# Altium project BEE-DAL_EXP.PrjPcb (part 1 of 2)
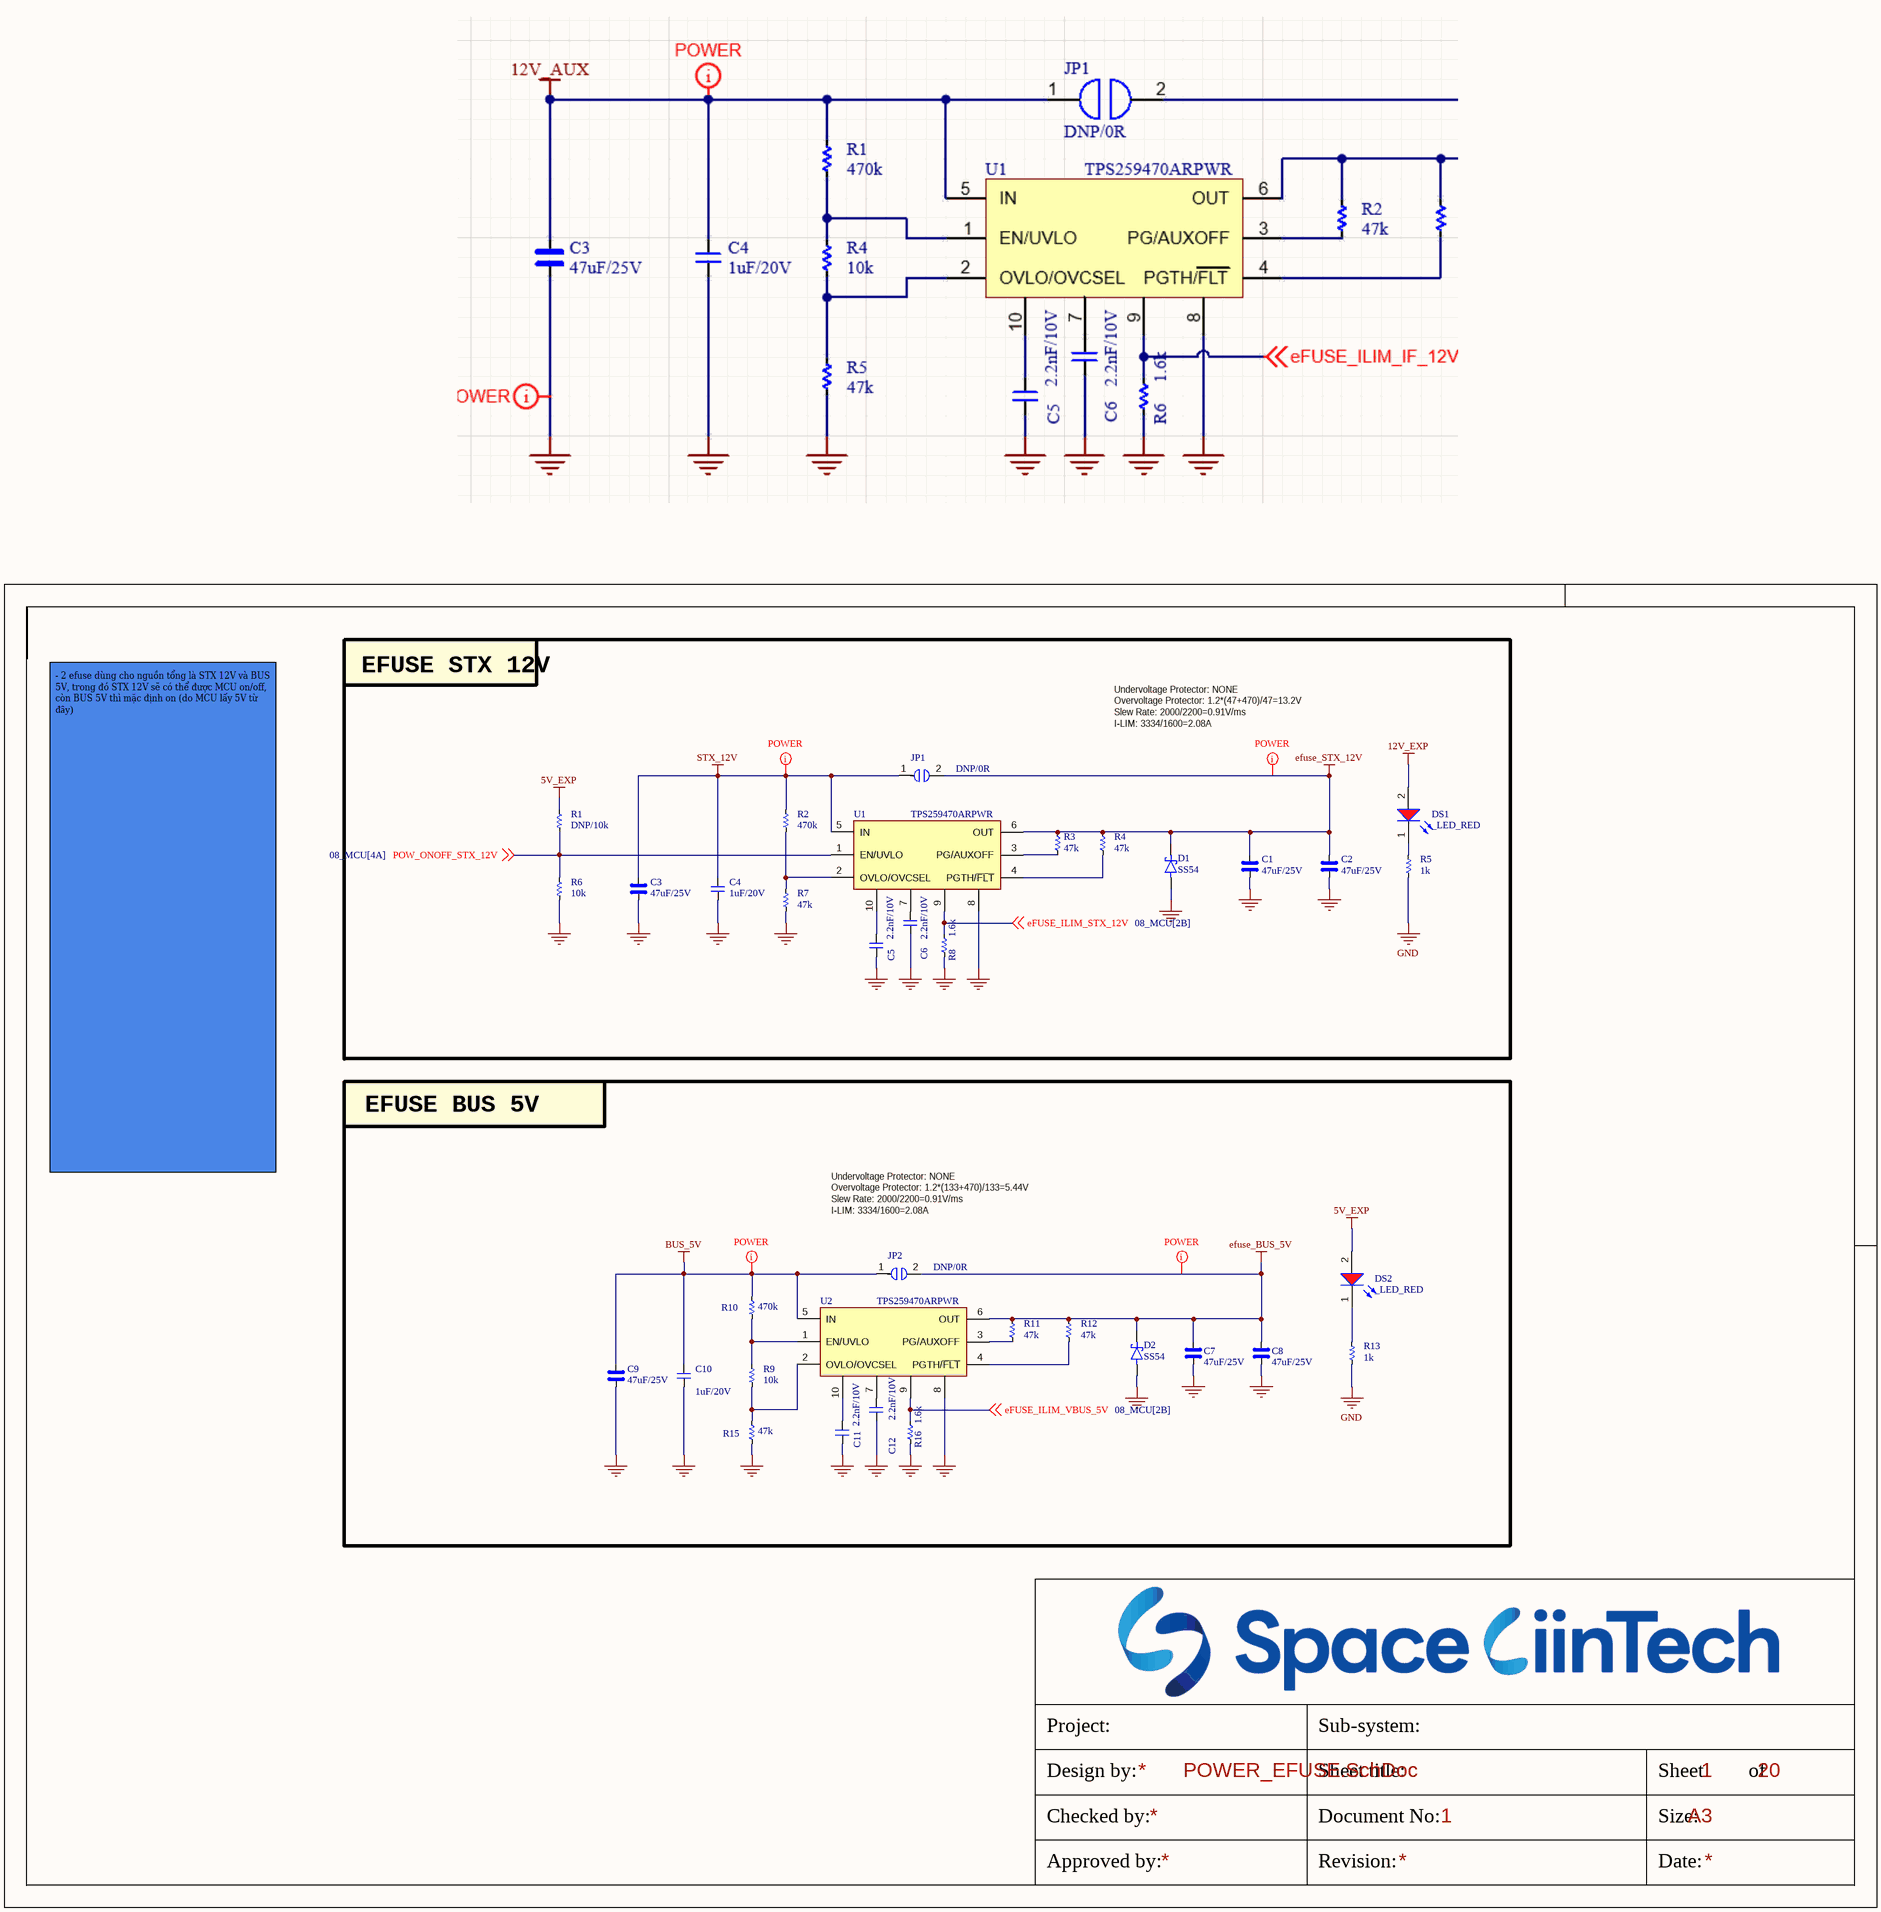
[diagram p0: POWER_EFUSE.SchDoc]
19 sheets, 584 parts. Net scope: flat (ports and power ports of the same name join across sheets).
Sheets:
  POWER_EFUSE.SchDoc
  07_CAN.SchDoc
  09_CONSOLE.SchDoc
  08_MCU.SchDoc
  10_PRAM_RTC_WDT.SchDoc
  13_FLOW_Sensor.SchDoc
  14_I2C_Sensor_OnBoard.SchDoc
  15_HD_PUMP.SchDoc
  16_SOLENOID_HB_1.SchDoc
  IR_LED.SchDoc
  STEP_MOTOR_DRIVER_1.SchDoc
  STEP_MOTOR_DRIVER_2.SchDoc
  STEP_MOTOR_ISOLATOR_INPUT.SchDoc
  CONNECTOR_INTERFACE.SchDoc
  POWER_MEASUREMENT.SchDoc
  POWER.SchDoc
  FUNCTION_EFUSE.SchDoc
  RS485.SchDoc
  CAM_CONNECTOR.SchDoc

## Sheet POWER_EFUSE.SchDoc
size 420 x 297 mm; SheetNumber: 1; SheetTotal: 20

### Parts
C1  47uF/25V  [CAP_C_3225X80]
C2  47uF/25V  [CAP_C_3225X80]
C3  47uF/25V  [CAP_C_3225X80]
C4  1uF/20V  [CAP_C_1005X50_L]
C5  2.2nF/10V  [CAP_C_1005X50_L]
C6  2.2nF/10V  [CAP_C_1005X50_L]
C7  47uF/25V  [CAP_C_3225X80]
C8  47uF/25V  [CAP_C_3225X80]
C9  47uF/25V  [CAP_C_3225X80]
C10  1uF/20V  [CAP_C_1005X50_L]
C11  2.2nF/10V  [CAP_C_1005X50_L]
C12  2.2nF/10V  [CAP_C_1005X50_L]
D1  SS54  [DO-214AC_SMA]
D2  SS54  [DO-214AC_SMA]
DS1  _LED_RED  [LED_0603]
DS2  _LED_RED  [LED_0603]
JP1  DNP/0R  [JUMPER_1608]
JP2  DNP/0R  [JUMPER_1608]
R1  DNP/10k  [RES_C_1005X40]
R2  470k  [RES_C_1005X40]
R3  47k  [RES_C_1005X40]
R4  47k  [RES_C_1005X40]
R5  1k  [RES_C_1005X40]
R6  10k  [RES_C_1005X40]
R7  47k  [RES_C_1005X40]
R8  1.6k  [RES_C_1005X40]
R9  10k  [RES_C_1005X40]
R10  470k  [RES_C_1005X40]
R11  47k  [RES_C_1005X40]
R12  47k  [RES_C_1005X40]
R13  1k  [RES_C_1005X40]
R15  47k  [RES_C_1005X40]
R16  1.6k  [RES_C_1005X40]
U1  TPS259470ARPWR  [VQFN-HR-10]
U2  TPS259470ARPWR  [VQFN-HR-10]

### Blocks framed on the sheet
EFUSE STX 12V: C1-C6 D1 DS1 JP1 R1-R8 U1
EFUSE BUS 5V: C7-C12 D2 DS2 JP2 R9-R13 R15 R16 U2

### Nets
5V_EXP: DS2.2(A) R1.1
12V_EXP: DS1.2(A)
BUS_5V: C9.2 C10.2 JP2.1 R10.2 U2.5(IN)
efuse_BUS_5V: C7.2 C8.2 D2.1(K) JP2.2 R11.2 R12.2 U2.6(OUT)
efuse_STX_12V: C1.2 C2.2 D1.1(K) JP1.2 R3.2 R4.2 U1.6(OUT)
GND: C1.1 C2.1 C3.1 C4.1 C5.1 C6.1 C7.1 C8.1 C9.1 C10.1 C11.1 C12.1 D1.2(A) D2.2(A) R5.1 R6.2 R7.1 R8.1 R13.1 R15.1 R16.1 U1.8 U2.8
STX_12V: C3.2 C4.2 JP1.1 R2.2 U1.5(IN)
eFUSE_ILIM_STX_12V: R8.2 U1.9 ; off-sheet eFUSE_ILIM_STX_12V
eFUSE_ILIM_VBUS_5V: R16.2 U2.9 ; off-sheet eFUSE_ILIM_VBUS_5V
POW_ONOFF_STX_12V: R1.2 R6.1 U1.1(EN/UVLO) ; off-sheet POW_ONOFF_STX_12V
NetC5_2: C5.2 U1.10
NetC6_2: C6.2 U1.7
NetC11_2: C11.2 U2.10
NetC12_2: C12.2 U2.7
NetDS1_1: DS1.1(K) R5.2
NetDS2_1: DS2.1(K) R13.2
NetR2_1: R2.1 R7.2 U1.2(OVLO/OVCSEL)
NetR3_1: R3.1 U1.3(PG/AUXOFF)
NetR4_1: R4.1 U1.4(PGTH/~{FLT})
NetR9_1: R9.1 R15.2 U2.2(OVLO/OVCSEL)
NetR9_2: R9.2 R10.1 U2.1(EN/UVLO)
NetR11_1: R11.1 U2.3(PG/AUXOFF)
NetR12_1: R12.1 U2.4(PGTH/~{FLT})

### Layout directives
net class POWER: BUS_5V, efuse_BUS_5V, efuse_STX_12V, STX_12V

### Notes on the sheet
- Undervoltage Protector: NONE
- Overvoltage Protector: 1.2*(47+470)/47=13.2V
- Slew Rate: 2000/2200=0.91V/ms
- I-LIM: 3334/1600=2.08A
- - 2 efuse dùng cho nguồn tổng là STX 12V và BUS 5V, trong đó STX 12V sẽ có thể được MCU on/off, còn BUS 5V thì mặc định on (do MCU lấy 5V từ đây)
- Overvoltage Protector: 1.2*(133+470)/133=5.44V
- Project:
- Sub-system:
- Design by:
- Sheet title:
- Sheet
- of
- Checked by:
- Approved by:
- Revision:
- Document No:
- Size:
- Date:
- A3

### Library data of the parts
C1-C3 C7-C9 = _CAP_C_High_2: CAP High Value
C4-C6 C10-C12 = _CAP_C_2: CAP
D1 D2 = DIODE SCHOTTKY
JP1 JP2 = JUMPER_1_1
R1-R13 R15 R16 = _RES_B_2: RES

## Sheet 07_CAN.SchDoc
size 420 x 297 mm; SheetNumber: 2; SheetTotal: 20
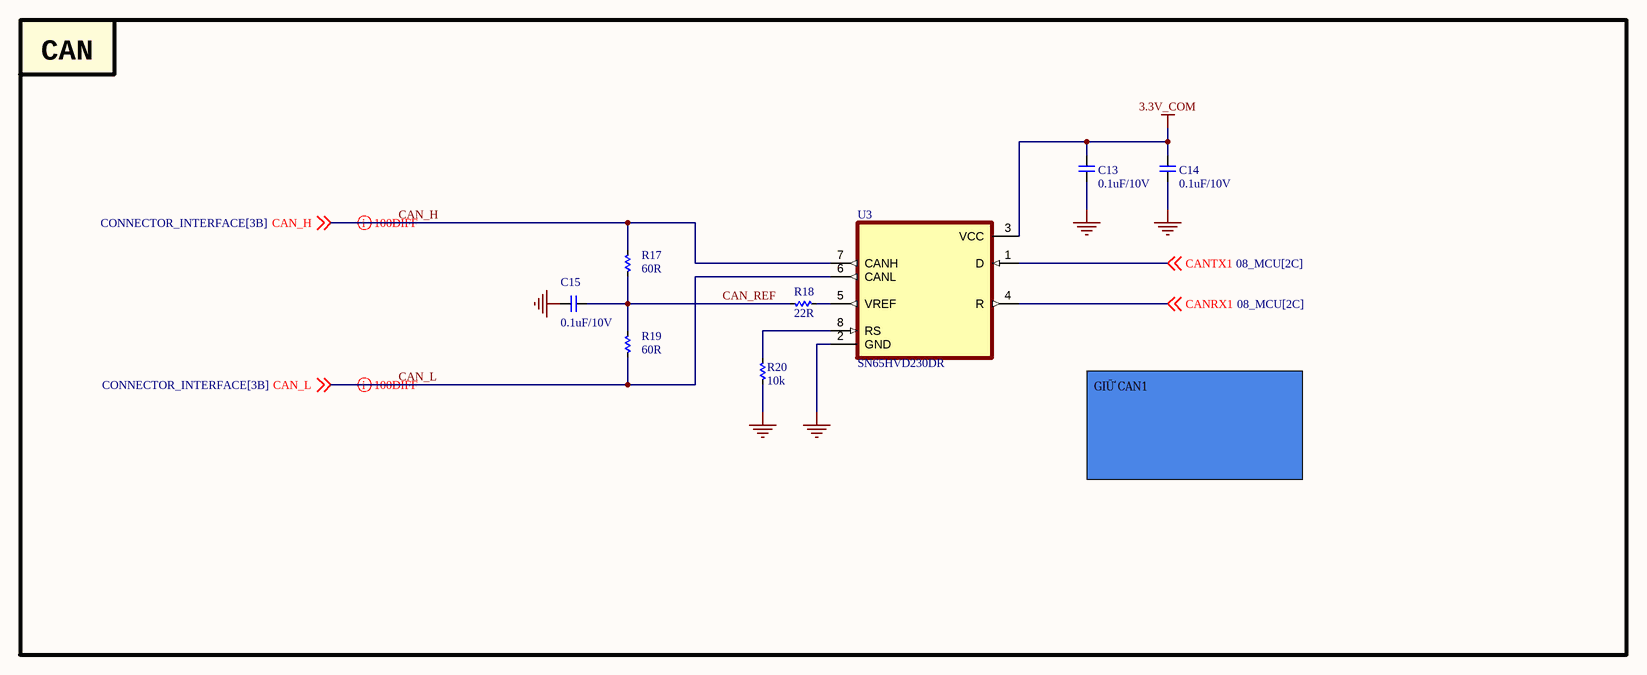
[diagram p1: 07_CAN.SchDoc]

### Parts
C13  0.1uF/10V  [CAP_C_1005X50_L]
C14  0.1uF/10V  [CAP_C_1005X50_L]
C15  0.1uF/10V  [CAP_C_1005X50_L]
R17  60R  [RES_C_1005X40]
R18  22R  [RES_C_1005X40]
R19  60R  [RES_C_1005X40]
R20  10k  [RES_C_1005X40]
U3  SN65HVD230DR  [SOIC127P600X175-8N]

### Blocks framed on the sheet
CAN: C13-C15 R17-R20 U3

### Nets
3.3V_COM: C13.1 C14.1 U3.3(VCC)
GND: C13.2 C14.2 C15.2 R20.1 U3.2(GND)
CAN_H: R17.2 U3.7(CANH) ; off-sheet CAN_H
CAN_L: R19.1 U3.6(CANL) ; off-sheet CAN_L
CAN_REF: C15.1 R17.1 R18.1 R19.2
CANRX1: U3.4(R) ; off-sheet CANRX1
CANTX1: U3.1(D) ; off-sheet CANTX1
NetR18_2: R18.2 U3.5(VREF)
NetR20_2: R20.2 U3.8(RS)

### Layout directives
differential pair; differential pair class DIFF100: CAN_H, CAN_L

### Notes on the sheet
- GIỮ CAN1
- Project:
- Sub-system:
- Design by:
- Sheet title:
- Sheet
- of
- Checked by:
- Approved by:
- Revision:
- Document No:
- Size:
- Date:
- A3

### Library data of the parts
C13-C15 = _CAP_C_2: CAP
R17-R20 = _RES_B_2: RES
U3 = SN65HVD230DR: 3.3 V CAN Transceiver with Standby Mode; MF: Texas Instruments; SnapEDA_Link: https://www.snapeda.com/parts/SN65HVD230DR/Texas+Instruments/view-part/?ref=snap; Package: SOIC-8 Texas Instruments; Value: *; MP: SN65HVD230DR; Check_prices: https://www.snapeda.com/parts/SN65HVD230DR/Texas+Instruments/view-part/?ref=eda

## Sheet 09_CONSOLE.SchDoc
size 420 x 297 mm; SheetNumber: 3; SheetTotal: 20
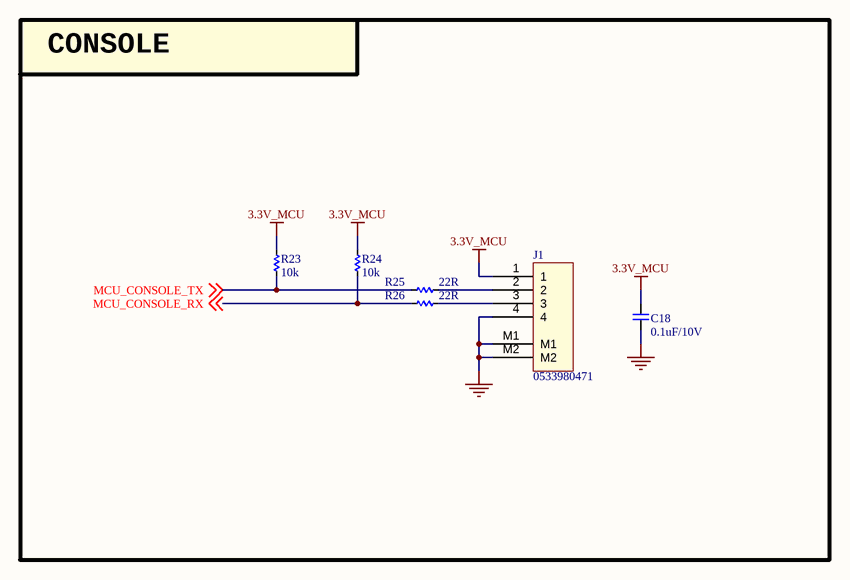
[diagram p2: 09_CONSOLE.SchDoc]

### Parts
C18  0.1uF/10V  [CAP_C_1005X50_L]
J1  0533980471  [MOLEX_0533980471]
R23  10k  [RES_C_1005X40]
R24  10k  [RES_C_1005X40]
R25  22R  [RES_C_1005X40]
R26  22R  [RES_C_1005X40]

### Blocks framed on the sheet
CONSOLE: C18 J1 R23-R26

### Nets
3.3V_MCU: C18.2 J1.1 R23.2 R24.2
GND: C18.1 J1.4 J1.M1 J1.M2
MCU_CONSOLE_RX: R24.1 R26.2 ; off-sheet MCU_CONSOLE_RX
MCU_CONSOLE_TX: R23.1 R25.2 ; off-sheet MCU_CONSOLE_TX
NetJ1_2: J1.2 R25.1
NetJ1_3: J1.3 R26.1

### Notes on the sheet
- Project:
- Sub-system:
- Design by:
- Sheet title:
- Sheet
- of
- Checked by:
- Approved by:
- Revision:
- Document No:
- Size:
- Date:
- A3

### Library data of the parts
C18 = _CAP_C_2: CAP
J1 = Header 4x1_2M
R23-R26 = _RES_B_2: RES

## Sheet 08_MCU.SchDoc
size 420 x 297 mm; SheetNumber: 8; SheetTotal: 27
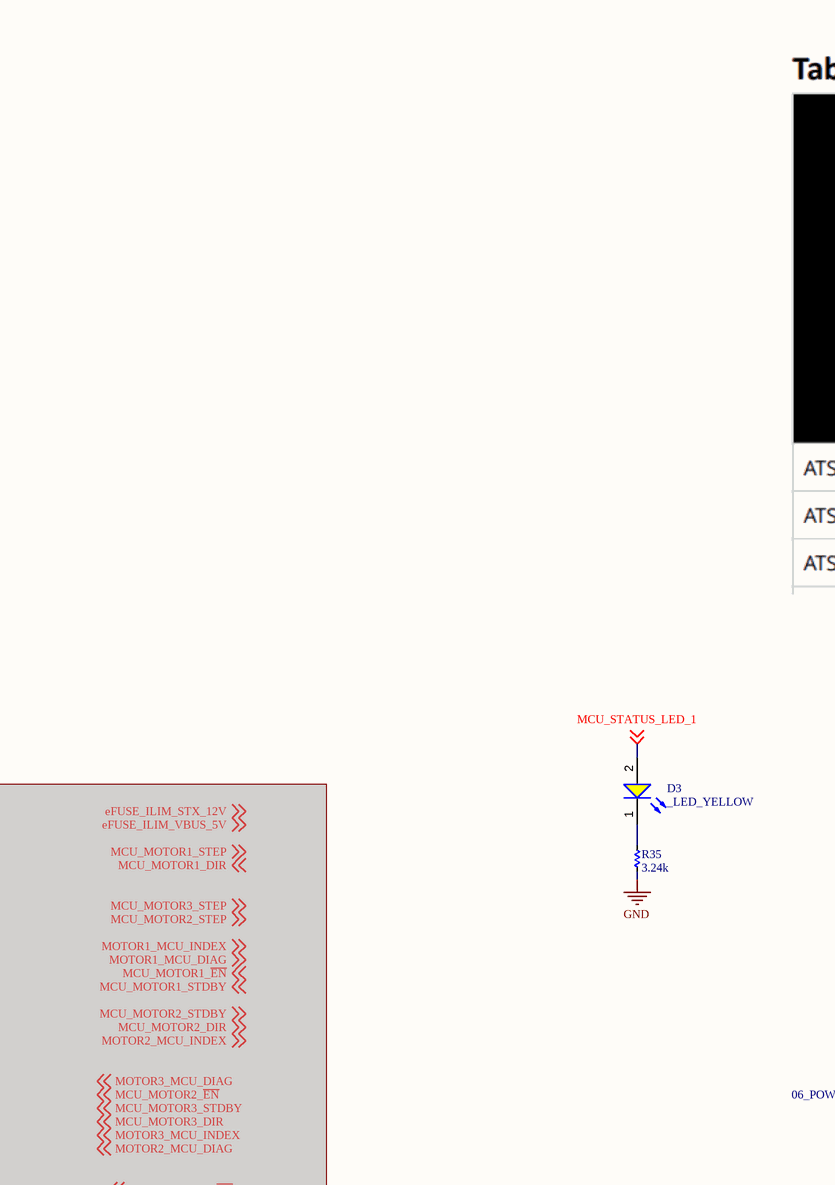
[diagram p3: 08_MCU.SchDoc, top left]
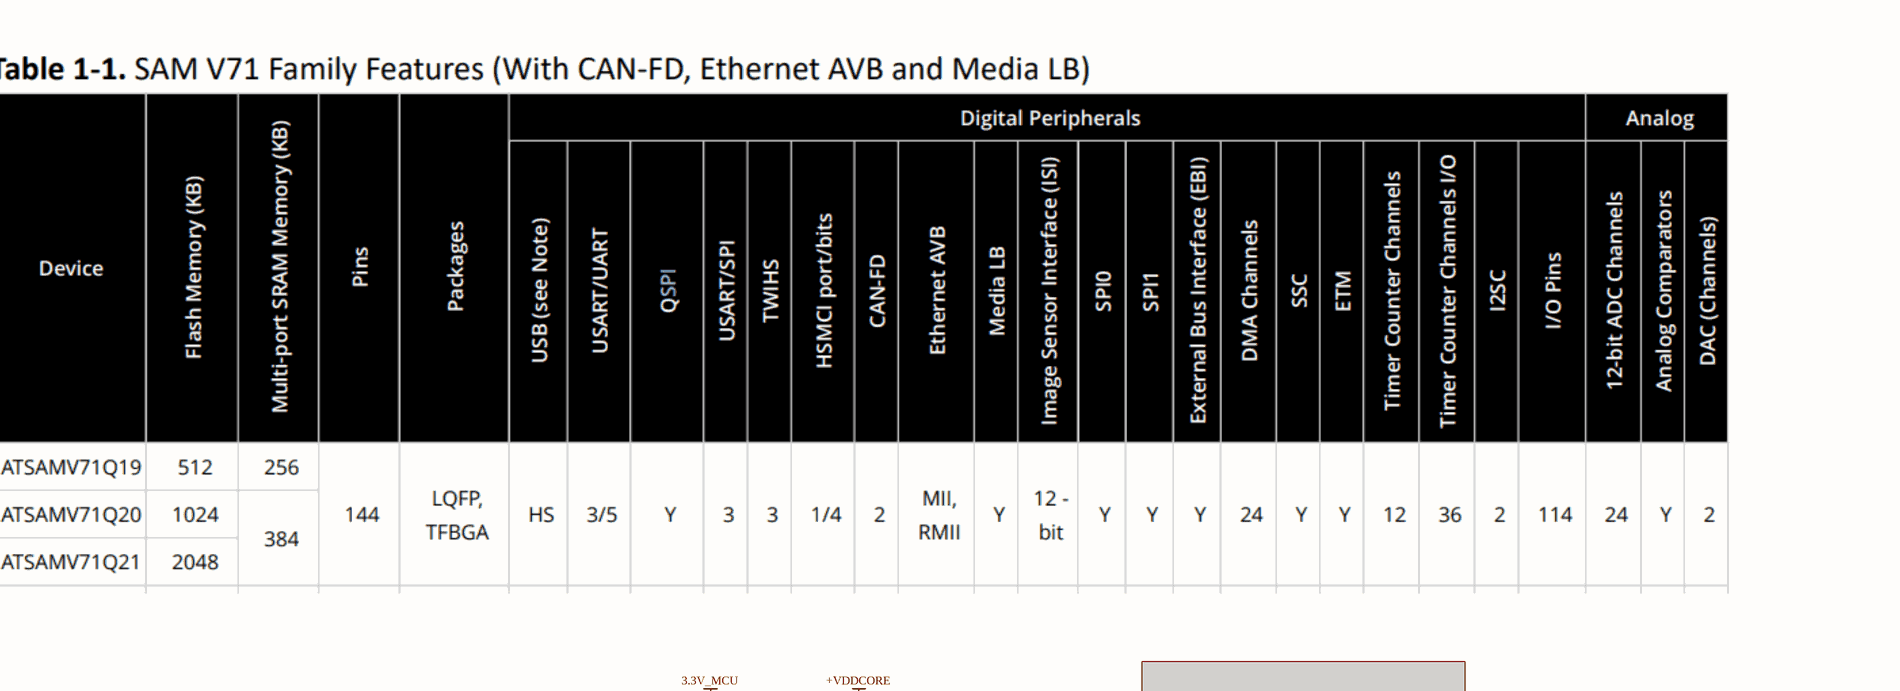
[diagram p4: 08_MCU.SchDoc, top right]
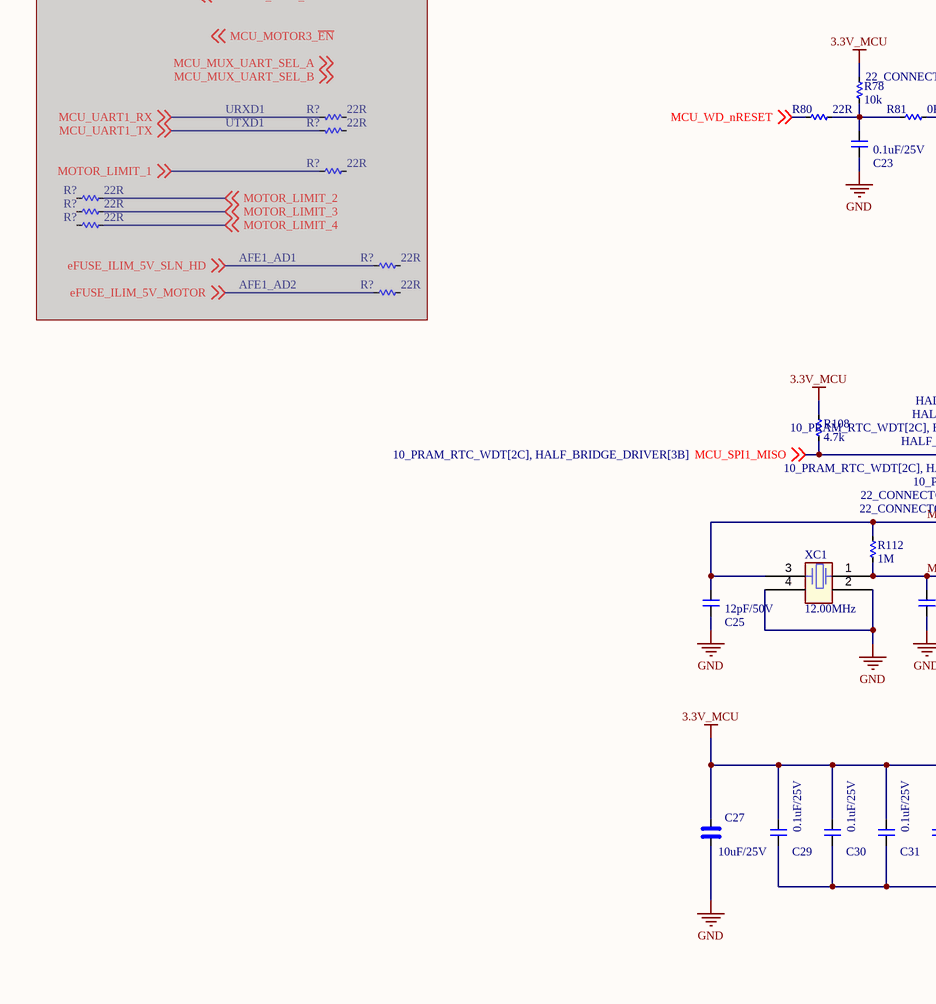
[diagram p5: 08_MCU.SchDoc, bottom left]
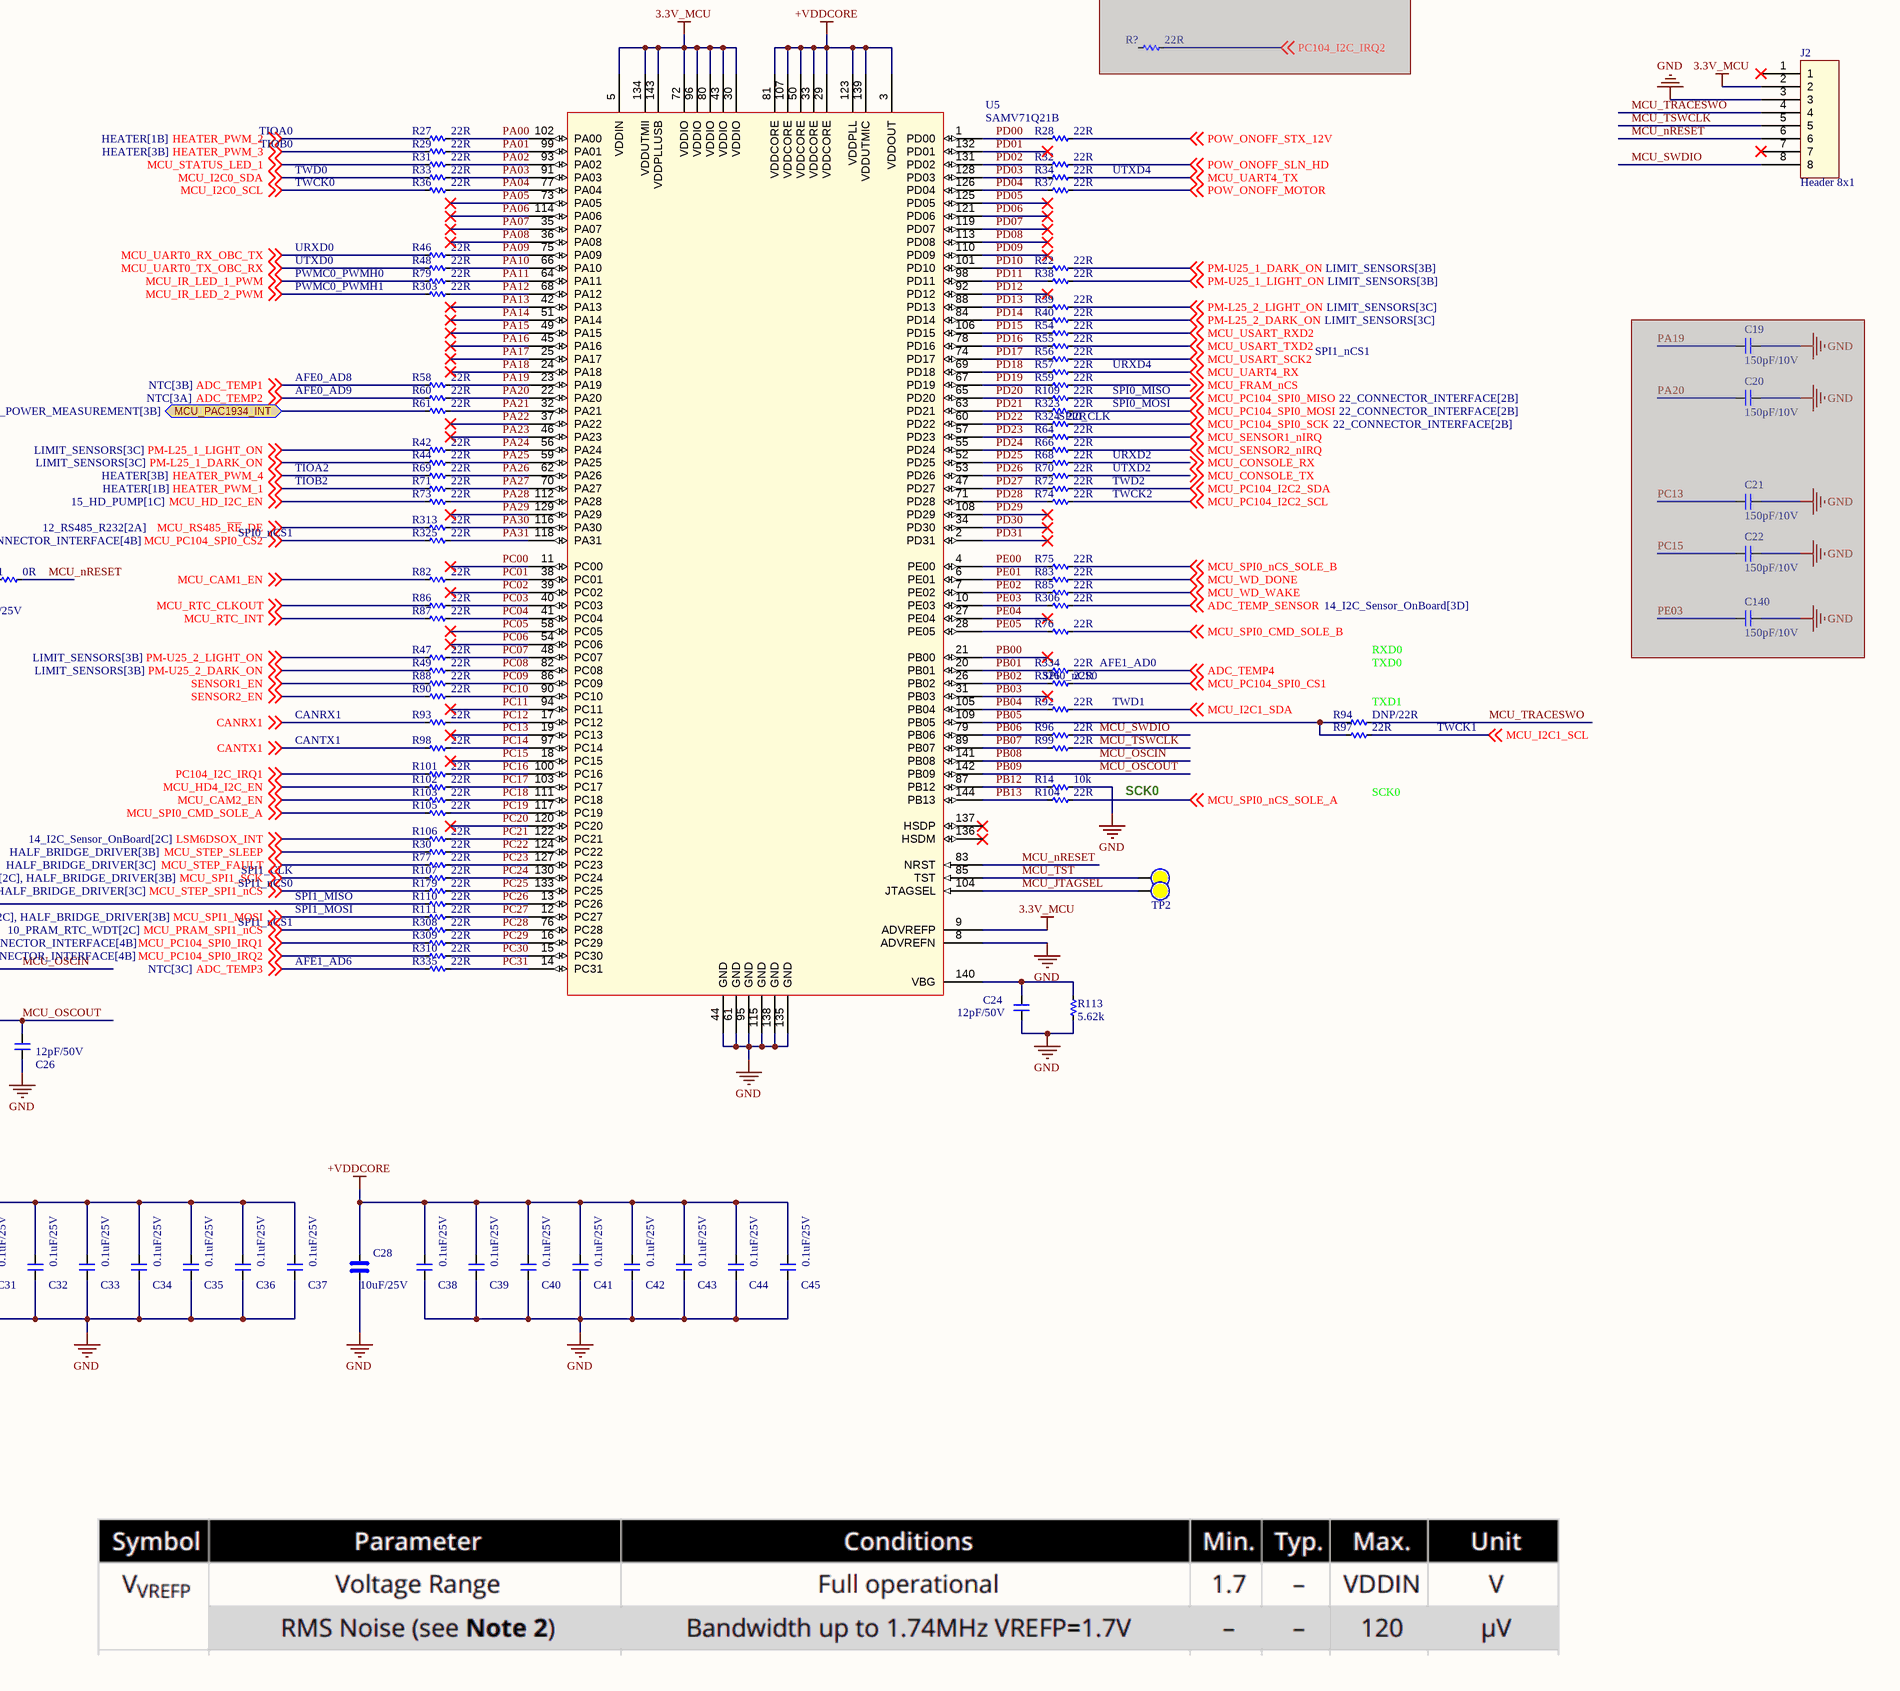
[diagram p6: 08_MCU.SchDoc, bottom right]

### Parts
(Parts that share a designator on the sheet are numbered #1, #2 ... from top to bottom, then left to right.)
C19  150pF/10V  [CAP_C_1005X60]  (masked out: inside a compile mask, not in the netlist)
C20  150pF/10V  [CAP_C_1005X60]  (masked out: inside a compile mask, not in the netlist)
C21  150pF/10V  [CAP_C_1005X60]  (masked out: inside a compile mask, not in the netlist)
C22  150pF/10V  [CAP_C_1005X60]  (masked out: inside a compile mask, not in the netlist)
C23  0.1uF/25V  [CAP_C_1005X60]
C24  12pF/50V  [CAP_C_1005X60]
C25  12pF/50V  [CAP_C_1005X60]
C26  12pF/50V  [CAP_C_1005X60]
C27  10uF/25V  [CAP_C_2012X110]
C28  10uF/25V  [CAP_C_2012X110]
C29  0.1uF/25V  [CAP_C_1005X60]
C30  0.1uF/25V  [CAP_C_1005X60]
C31  0.1uF/25V  [CAP_C_1005X60]
C32  0.1uF/25V  [CAP_C_1005X60]
C33  0.1uF/25V  [CAP_C_1005X60]
C34  0.1uF/25V  [CAP_C_1005X60]
C35  0.1uF/25V  [CAP_C_1005X60]
C36  0.1uF/25V  [CAP_C_1005X60]
C37  0.1uF/25V  [CAP_C_1005X60]
C38  0.1uF/25V  [CAP_C_1005X60]
C39  0.1uF/25V  [CAP_C_1005X60]
C40  0.1uF/25V  [CAP_C_1005X60]
C41  0.1uF/25V  [CAP_C_1005X60]
C42  0.1uF/25V  [CAP_C_1005X60]
C43  0.1uF/25V  [CAP_C_1005X60]
C44  0.1uF/25V  [CAP_C_1005X60]
C45  0.1uF/25V  [CAP_C_1005X60]
C140#1  150pF/10V  [CAP_C_1005X60]  (masked out: inside a compile mask, not in the netlist)
D3  _LED_YELLOW  [LED_0603]
J2  Header 8x1  [Header_254P_8x1]
R14  10k  [RES_C_1005X40]
R22  22R  [RES_C_1005X40]
R27  22R  [RES_C_1005X40]
R28  22R  [RES_C_1005X40]
R29  22R  [RES_C_1005X40]
R30  22R  [RES_C_1005X40]
R31  22R  [RES_C_1005X40]
R32  22R  [RES_C_1005X40]
R33  22R  [RES_C_1005X40]
R34  22R  [RES_C_1005X40]
R35  3.24k  [RES_C_1005X40]
R36  22R  [RES_C_1005X40]
R37  22R  [RES_C_1005X40]
R38  22R  [RES_C_1005X40]
R39  22R  [RES_C_1005X40]
R40  22R  [RES_C_1005X40]
R42  22R  [RES_C_1005X40]
R44  22R  [RES_C_1005X40]
R46  22R  [RES_C_1005X40]
R47  22R  [RES_C_1005X40]
R48  22R  [RES_C_1005X40]
R49  22R  [RES_C_1005X40]
R54  22R  [RES_C_1005X40]
R55  22R  [RES_C_1005X40]
R56  22R  [RES_C_1005X40]
R57  22R  [RES_C_1005X40]
R58  22R  [RES_C_1005X40]
R59  22R  [RES_C_1005X40]
R60  22R  [RES_C_1005X40]
R61  22R  [RES_C_1005X40]
R64  22R  [RES_C_1005X40]
R66  22R  [RES_C_1005X40]
R68  22R  [RES_C_1005X40]
R69  22R  [RES_C_1005X40]
R70  22R  [RES_C_1005X40]
R71  22R  [RES_C_1005X40]
R72  22R  [RES_C_1005X40]
R73  22R  [RES_C_1005X40]
R74  22R  [RES_C_1005X40]
R75  22R  [RES_C_1005X40]
R76  22R  [RES_C_1005X40]
R77#1  22R  [RES_C_1005X40]
R78  10k  [RES_C_1005X40]
R79  22R  [RES_C_1005X40]
R80  22R  [RES_C_1005X40]
R81  0R  [RES_C_1005X40]
R82  22R  [RES_C_1005X40]
R83  22R  [RES_C_1005X40]
R85  22R  [RES_C_1005X40]
R86  22R  [RES_C_1005X40]
R87  22R  [RES_C_1005X40]
R88  22R  [RES_C_1005X40]
R90  22R  [RES_C_1005X40]
R92  22R  [RES_C_1005X40]
R93  22R  [RES_C_1005X40]
R94  DNP/22R  [RES_C_1005X40]
R96  22R  [RES_C_1005X40]
R97  22R  [RES_C_1005X40]
R98  22R  [RES_C_1005X40]
R99  22R  [RES_C_1005X40]
R101  22R  [RES_C_1005X40]
R102  22R  [RES_C_1005X40]
R103  22R  [RES_C_1005X40]
R104  22R  [RES_C_1005X40]
R105  22R  [RES_C_1005X40]
R106  22R  [RES_C_1005X40]
R107  22R  [RES_C_1005X40]
R108  4.7k  [RES_C_1005X40]
R109  22R  [RES_C_1005X40]
R110  22R  [RES_C_1005X40]
R111  22R  [RES_C_1005X40]
R112  1M  [RES_C_1005X40]
R113  5.62k  [RES_C_1005X40]
R179#1  22R  [RES_C_1005X40]
R303  22R  [RES_C_1005X40]
R306  22R  [RES_C_1005X40]
R308  22R  [RES_C_1005X40]
R309  22R  [RES_C_1005X40]
R310  22R  [RES_C_1005X40]
R313  22R  [RES_C_1005X40]
R323  22R  [RES_C_1005X40]
R324  22R  [RES_C_1005X40]
R325  22R  [RES_C_1005X40]
R326  22R  [RES_C_1005X40]
R334  22R  [RES_C_1005X40]
R335  22R  [RES_C_1005X40]
R?#1  22R  [RES_C_1005X40]  (masked out: inside a compile mask, not in the netlist)
R?#2  22R  [RES_C_1005X40]  (masked out: inside a compile mask, not in the netlist)
R?#3  22R  [RES_C_1005X40]  (masked out: inside a compile mask, not in the netlist)
R?#4  22R  [RES_C_1005X40]  (masked out: inside a compile mask, not in the netlist)
R?#5  22R  [RES_C_1005X40]  (masked out: inside a compile mask, not in the netlist)
R?#6  22R  [RES_C_1005X40]  (masked out: inside a compile mask, not in the netlist)
R?#7  22R  [RES_C_1005X40]  (masked out: inside a compile mask, not in the netlist)
R?#8  22R  [RES_C_1005X40]  (masked out: inside a compile mask, not in the netlist)
R?#9  22R  [RES_C_1005X40]  (masked out: inside a compile mask, not in the netlist)
TP1  (no value)  [Testpoint_80]  (no BOM)
TP2  (no value)  [Testpoint_80]  (no BOM)
U5  SAMV71Q21B  [AP6-00118]
XC1  value 12.00MHz  [AP7-00039]  (hidden comment: FC5BQCCMC12.0-T1)

### Ports
MCU_PAC1934_INT (bidir, see 06_POWER_MEASUREMENT[3B])

### Nets
3.3V_MCU: C27.1 C29.2 C30.2 C31.2 C32.2 C33.2 C34.2 C35.2 C36.2 C37.2 J2.2 R78.2 R108.1 U5.5(VDDIN) U5.9(ADVREFP) U5.30(VDDIO) U5.43(VDDIO) U5.72(VDDIO) U5.80(VDDIO) U5.96(VDDIO) U5.134(VDDUTMII) U5.143(VDDPLLUSB)
+VDDCORE: C28.1 C38.2 C39.2 C40.2 C41.2 C42.2 C43.2 C44.2 C45.2 U5.3(VDDOUT) U5.29(VDDCORE) U5.33(VDDCORE) U5.50(VDDCORE) U5.81(VDDCORE) U5.107(VDDCORE) U5.123(VDDPLL) U5.139(VDDUTMIC)
GND: C23.1 C24.1 C25.1 C26.1 C27.2 C28.2 C29.1 C30.1 C31.1 C32.1 C33.1 C34.1 C35.1 C36.1 C37.1 C38.1 C39.1 C40.1 C41.1 C42.1 C43.1 C44.1 C45.1 J2.3 R14.1 R35.2 R113.1 U5.8(ADVREFN) U5.44(GND) U5.61(GND) U5.95(GND) U5.115(GND) U5.135(GND) U5.138(GND) XC1.2 XC1.4
ADC_TEMP1: R58.2 ; off-sheet ADC_TEMP1
ADC_TEMP2: R60.2 ; off-sheet ADC_TEMP2
ADC_TEMP3: R335.2 ; off-sheet ADC_TEMP3
ADC_TEMP4: R334.1 ; off-sheet ADC_TEMP4
ADC_TEMP_SENSOR: R306.1 ; off-sheet ADC_TEMP_SENSOR  [project net TEMP _SENSOR]
CANRX1: R93.2 ; off-sheet CANRX1
CANTX1: R98.2 ; off-sheet CANTX1
HEATER_PWM_1: R71.2 ; off-sheet HEATER_PWM_1
HEATER_PWM_2: R27.2 ; off-sheet HEATER_PWM_2
HEATER_PWM_3: R29.2 ; off-sheet HEATER_PWM_3
HEATER_PWM_4: R69.2 ; off-sheet HEATER_PWM_4
LSM6DSOX_INT: R106.2 ; off-sheet LSM6DSOX_INT
MCU_CAM1_EN: R82.2 ; off-sheet MCU_CAM1_EN
MCU_CAM2_EN: R103.2 ; off-sheet MCU_CAM2_EN
MCU_CONSOLE_RX: R68.1 ; off-sheet MCU_CONSOLE_RX
MCU_CONSOLE_TX: R70.1 ; off-sheet MCU_CONSOLE_TX
MCU_FRAM_nCS: R59.2 ; off-sheet MCU_FRAM_nCS
MCU_HD4_I2C_EN: R102.2 ; off-sheet MCU_HD4_I2C_EN
MCU_HD_I2C_EN: R73.2 ; off-sheet MCU_HD_I2C_EN
MCU_I2C0_SCL: R36.2 ; off-sheet MCU_I2C0_SCL
MCU_I2C0_SDA: R33.2 ; off-sheet MCU_I2C0_SDA
MCU_I2C1_SCL: R97.1 ; off-sheet MCU_I2C1_SCL
MCU_I2C1_SDA: R92.1 ; off-sheet MCU_I2C1_SDA
MCU_IR_LED_1_PWM: R79.2 ; off-sheet MCU_IR_LED_1_PWM
MCU_IR_LED_2_PWM: R303.2 ; off-sheet MCU_IR_LED_2_PWM
MCU_JTAGSEL: TP2.1 U5.104(JTAGSEL)
MCU_nRESET: J2.6 R81.1 U5.83(NRST)
MCU_OSCIN: C25.2 R112.2 U5.141(PB08) XC1.3  [also labelled PB08]
MCU_OSCOUT: C26.2 R112.1 U5.142(PB09) XC1.1  [also labelled PB09]
MCU_PC104_I2C2_SCL: R74.1 ; off-sheet MCU_PC104_I2C2_SCL
MCU_PC104_I2C2_SDA: R72.1 ; off-sheet MCU_PC104_I2C2_SDA
MCU_PC104_SPI0_CS1: R326.1 ; off-sheet MCU_PC104_SPI0_CS1
MCU_PC104_SPI0_CS2: R325.2 ; off-sheet MCU_PC104_SPI0_CS2
MCU_PC104_SPI0_IRQ1: R309.2 ; off-sheet MCU_PC104_SPI0_IRQ1
MCU_PC104_SPI0_IRQ2: R310.2 ; off-sheet MCU_PC104_SPI0_IRQ2
MCU_PC104_SPI0_MISO: R109.1 ; off-sheet MCU_PC104_SPI0_MISO
MCU_PC104_SPI0_MOSI: R323.1 ; off-sheet MCU_PC104_SPI0_MOSI
MCU_PC104_SPI0_SCK: R324.2 ; off-sheet MCU_PC104_SPI0_SCK
MCU_PRAM_SPI1_nCS: R308.2 ; off-sheet MCU_PRAM_SPI1_nCS
MCU_RS485_~{RE}_DE: R313.2 ; off-sheet MCU_RS485_~{RE}_DE
MCU_RTC_CLKOUT: R86.2 ; off-sheet MCU_RTC_CLKOUT
MCU_RTC_INT: R87.2 ; off-sheet MCU_RTC_INT
MCU_SENSOR1_nIRQ: R64.1 ; off-sheet MCU_SENSOR1_nIRQ
MCU_SENSOR2_nIRQ: R66.1 ; off-sheet MCU_SENSOR2_nIRQ
MCU_SPI0_CMD_SOLE_A: R105.2 ; off-sheet MCU_SPI0_CMD_SOLE_A
MCU_SPI0_CMD_SOLE_B: R76.1 ; off-sheet MCU_SPI0_CMD_SOLE_B
MCU_SPI0_nCS_SOLE_A: R104.1 ; off-sheet MCU_SPI0_nCS_SOLE_A
MCU_SPI0_nCS_SOLE_B: R75.1 ; off-sheet MCU_SPI0_nCS_SOLE_B
MCU_SPI1_MISO: R108.2 R110.2 ; off-sheet MCU_SPI1_MISO
MCU_SPI1_MOSI: R111.2 ; off-sheet MCU_SPI1_MOSI
MCU_SPI1_SCK: R107.2 ; off-sheet MCU_SPI1_SCK
MCU_STATUS_LED_1: D3.2(A) R31.1 ; off-sheet MCU_STATUS_LED_1
MCU_STEP_FAULT: R77#1.2 ; off-sheet MCU_STEP_FAULT
MCU_STEP_SLEEP: R30.2 ; off-sheet MCU_STEP_SLEEP
MCU_STEP_SPI1_nCS: R179#1.2 ; off-sheet MCU_STEP_SPI1_nCS
MCU_SWDIO: J2.8 R96.1
MCU_TRACESWO: J2.4 R94.1
MCU_TST: TP1.1 U5.85(TST)
MCU_TSWCLK: J2.5 R99.1
MCU_UART0_RX_OBC_TX: R46.2 ; off-sheet MCU_UART0_RX_OBC_TX
MCU_UART0_TX_OBC_RX: R48.2 ; off-sheet MCU_UART0_TX_OBC_RX
MCU_UART4_RX: R57.1 ; off-sheet MCU_UART4_RX
MCU_UART4_TX: R34.1 ; off-sheet MCU_UART4_TX
MCU_USART_RXD2: R54.1 ; off-sheet MCU_USART_RXD2
MCU_USART_SCK2: R56.1 ; off-sheet MCU_USART_SCK2
MCU_USART_TXD2: R55.1 ; off-sheet MCU_USART_TXD2
MCU_WD_DONE: R83.1 ; off-sheet MCU_WD_DONE
MCU_WD_nRESET: R80.2 ; off-sheet MCU_WD_nRESET
MCU_WD_WAKE: R85.1 ; off-sheet MCU_WD_WAKE
PA00: R27.1 U5.102(PA00)
PA01: R29.1 U5.99(PA01)
PA02: R31.2 U5.93(PA02)
PA03: R33.1 U5.91(PA03)
PA04: R36.1 U5.77(PA04)
PA05: U5.73(PA05)
PA06: U5.114(PA06)
PA07: U5.35(PA07)
PA08: U5.36(PA08)
PA09: R46.1 U5.75(PA09)
PA10: R48.1 U5.66(PA10)
PA11: R79.1 U5.64(PA11)
PA12: R303.1 U5.68(PA12)
PA13: U5.42(PA13)
PA14: U5.51(PA14)
PA15: U5.49(PA15)
PA16: U5.45(PA16)
PA17: U5.25(PA17)
PA18: U5.24(PA18)
PA19: R58.1 U5.23(PA19)
PA20: R60.1 U5.22(PA20)
PA21: R61.1 U5.32(PA21)
PA22: U5.37(PA22)
PA23: U5.46(PA23)
PA24: R42.1 U5.56(PA24)
PA25: R44.1 U5.59(PA25)
PA26: R69.1 U5.62(PA26)
PA27: R71.1 U5.70(PA27)
PA28: R73.1 U5.112(PA28)
PA29: U5.129(PA29)
PA30: R313.1 U5.116(PA30)
PA31: R325.1 U5.118(PA31)
PB00: U5.21(PB00)
PB01: R334.2 U5.20(PB01)
PB02: R326.2 U5.26(PB02)
PB03: U5.31(PB03)
PB04: R92.2 U5.105(PB04)
PB05: R94.2 R97.2 U5.109(PB05)
PB06: R96.2 U5.79(PB06)
PB07: R99.2 U5.89(PB07)
PB12: R14.2 U5.87(PB12)
PB13: R104.2 U5.144(PB13)
PC00: U5.11(PC00)
PC01: R82.1 U5.38(PC01)
PC02: U5.39(PC02)
PC03: R86.1 U5.40(PC03)
PC04: R87.1 U5.41(PC04)
PC05: U5.58(PC05)
PC06: U5.54(PC06)
PC07: R47.1 U5.48(PC07)
PC08: R49.1 U5.82(PC08)
PC09: R88.1 U5.86(PC09)
PC10: R90.1 U5.90(PC10)
PC11: U5.94(PC11)
PC12: R93.1 U5.17(PC12)
PC13: U5.19(PC13)
PC14: R98.1 U5.97(PC14)
PC15: U5.18(PC15)
PC16: R101.1 U5.100(PC16)
PC17: R102.1 U5.103(PC17)
PC18: R103.1 U5.111(PC18)
PC19: R105.1 U5.117(PC19)
PC20: U5.120(PC20)
PC21: R106.1 U5.122(PC21)
PC22: R30.1 U5.124(PC22)
PC23: R77#1.1 U5.127(PC23)
PC24: R107.1 U5.130(PC24)
PC25: R179#1.1 U5.133(PC25)
PC26: R110.1 U5.13(PC26)
PC27: R111.1 U5.12(PC27)
PC28: R308.1 U5.76(PC28)
PC29: R309.1 U5.16(PC29)
PC30: R310.1 U5.15(PC30)
PC31: R335.1 U5.14(PC31)
PC104_I2C_IRQ1: R101.2 ; off-sheet PC104_I2C_IRQ1
PD00: R28.2 U5.1(PD00)
PD01: U5.132(PD01)
PD02: R32.2 U5.131(PD02)
PD03: R34.2 U5.128(PD03)
PD04: R37.2 U5.126(PD04)
PD05: U5.125(PD05)
PD06: U5.121(PD06)
PD07: U5.119(PD07)
PD08: U5.113(PD08)
PD09: U5.110(PD09)
PD10: R22.2 U5.101(PD10)
PD11: R38.2 U5.98(PD11)
PD12: U5.92(PD12)
PD13: R39.2 U5.88(PD13)
PD14: R40.2 U5.84(PD14)
PD15: R54.2 U5.106(PD15)
PD16: R55.2 U5.78(PD16)
PD17: R56.2 U5.74(PD17)
PD18: R57.2 U5.69(PD18)
PD19: R59.1 U5.67(PD19)
PD20: R109.2 U5.65(PD20)
PD21: R323.2 U5.63(PD21)
PD22: R324.1 U5.60(PD22)
PD23: R64.2 U5.57(PD23)
PD24: R66.2 U5.55(PD24)
PD25: R68.2 U5.52(PD25)
PD26: R70.2 U5.53(PD26)
PD27: R72.2 U5.47(PD27)
PD28: R74.2 U5.71(PD28)
PD29: U5.108(PD29)
PD30: U5.34(PD30)
PD31: U5.2(PD31)
PE00: R75.2 U5.4(PE00)
PE01: R83.2 U5.6(PE01)
PE02: R85.2 U5.7(PE02)
PE03: R306.2 U5.10(PE03)
PE04: U5.27(PE04)
PE05: R76.2 U5.28(PE05)
PM-L25_1_DARK_ON: R44.2 ; off-sheet PM-L25_1_DARK_ON
PM-L25_1_LIGHT_ON: R42.2 ; off-sheet PM-L25_1_LIGHT_ON
PM-L25_2_DARK_ON: R40.1 ; off-sheet PM-L25_2_DARK_ON
PM-L25_2_LIGHT_ON: R39.1 ; off-sheet PM-L25_2_LIGHT_ON
PM-U25_1_DARK_ON: R22.1 ; off-sheet PM-U25_1_DARK_ON
PM-U25_1_LIGHT_ON: R38.1 ; off-sheet PM-U25_1_LIGHT_ON
PM-U25_2_DARK_ON: R49.2 ; off-sheet PM-U25_2_DARK_ON
PM-U25_2_LIGHT_ON: R47.2 ; off-sheet PM-U25_2_LIGHT_ON
POW_ONOFF_MOTOR: R37.1 ; off-sheet POW_ONOFF_MOTOR
POW_ONOFF_SLN_HD: R32.1 ; off-sheet POW_ONOFF_SLN_HD
POW_ONOFF_STX_12V: R28.1 ; off-sheet POW_ONOFF_STX_12V
SENSOR1_EN: R88.2 ; off-sheet SENSOR1_EN
SENSOR2_EN: R90.2 ; off-sheet SENSOR2_EN
NetC23_2: C23.2 R78.1 R80.1 R81.2
NetC24_2: C24.2 R113.2 U5.140(VBG)
NetD3_1: D3.1(K) R35.1
NetR61_2: R61.2 ; port MCU_PAC1934_INT

Not connected (* = marked no-connect by the designer): J2 1* 7*; U5 136(HSDM)* 137(HSDP)*

### Notes on the sheet
- TIOA0
- TWD0
- TWCK0
- TIOB0
- UTXD4
- URXD0
- UTXD0
- PWMC0_PWMH0
- PWMC0_PWMH1
- AFE0_AD8
- AFE0_AD9
- URXD4
- SPI0_MISO
- SPI1_nCS1
- URXD2
- SPI0_MOSI
- SPI0_CLK
- TIOB2
- TIOA2
- TWD2
- TWCK2
- UTXD2
- URXD1
- UTXD1
- SPI0_nCS1
- RXD0
- AFE1_AD1
- CANRX1
- SPI0_nCS0
- AFE1_AD0
- TWD1
- TXD0
- (near R94) TXD1
- AFE1_AD2
- CANTX1
- TWCK1
- SCK0
- SPI1_MISO
- SPI1_MOSI
- SPI1_CLK
- SPI1_nCS0
- AFE1_AD6
- Project
- Sub-system:
- Design by:
- Sheet title:
- Sheet:
- of
- Checked by:
- Approved by:
- Doc no:
- Revision
- Size:
- Date:

### Library data of the parts
C19-C26 C29-C45 C140#1 = _CAP_C_2: CAP
C27 C28 = _CAP_C_High_2: CAP High Value
R14 R22 R27-R40 R42 R44 R46-R49 R54-R61 R64 R66 R68-R76 R77#1 R78-R83 R85-R88 R90 R92-R94 R96-R99 R101-R113 R179#1 R303 R306 R308-R310 R313 R323-R326 R334 R335 R?#1-R?#9 = _RES_B_2: RES
TP1 TP2 = Test Point: Solder: NF
U5 = SAMV71Q21B: SAM 32-bit ARM Cortex-M* RISC MCU, SAMV71B Series, QFP144; PartGroup: Integrated Circuits,MCU, MPU, DSP,ARM MCU; Manufacturer: MICROCHIP; MPN: ATSAMV71Q21B-AAB; AN: A06-1541; TemperatureRange: -40Â°C to +105Â°C; Height: 1,60000002384186; Value: SAMV71Q21B
XC1 = A07-0042: Fox FQ5032B 12.0MHz SMD crystal 738B-12; PartGroup: Frequency devices,Crystals,SMD; Manufacturer: Fox  Electronics; MPN: FQ5032B-12.000; Tolerance: Â±30ppm; TemperatureRange: 0Â°C ~ 70Â°C; AN: A07-0042; Height: 1,20000004768372

## Sheet 10_PRAM_RTC_WDT.SchDoc
size 420 x 297 mm; SheetNumber: 10; SheetTotal: 27
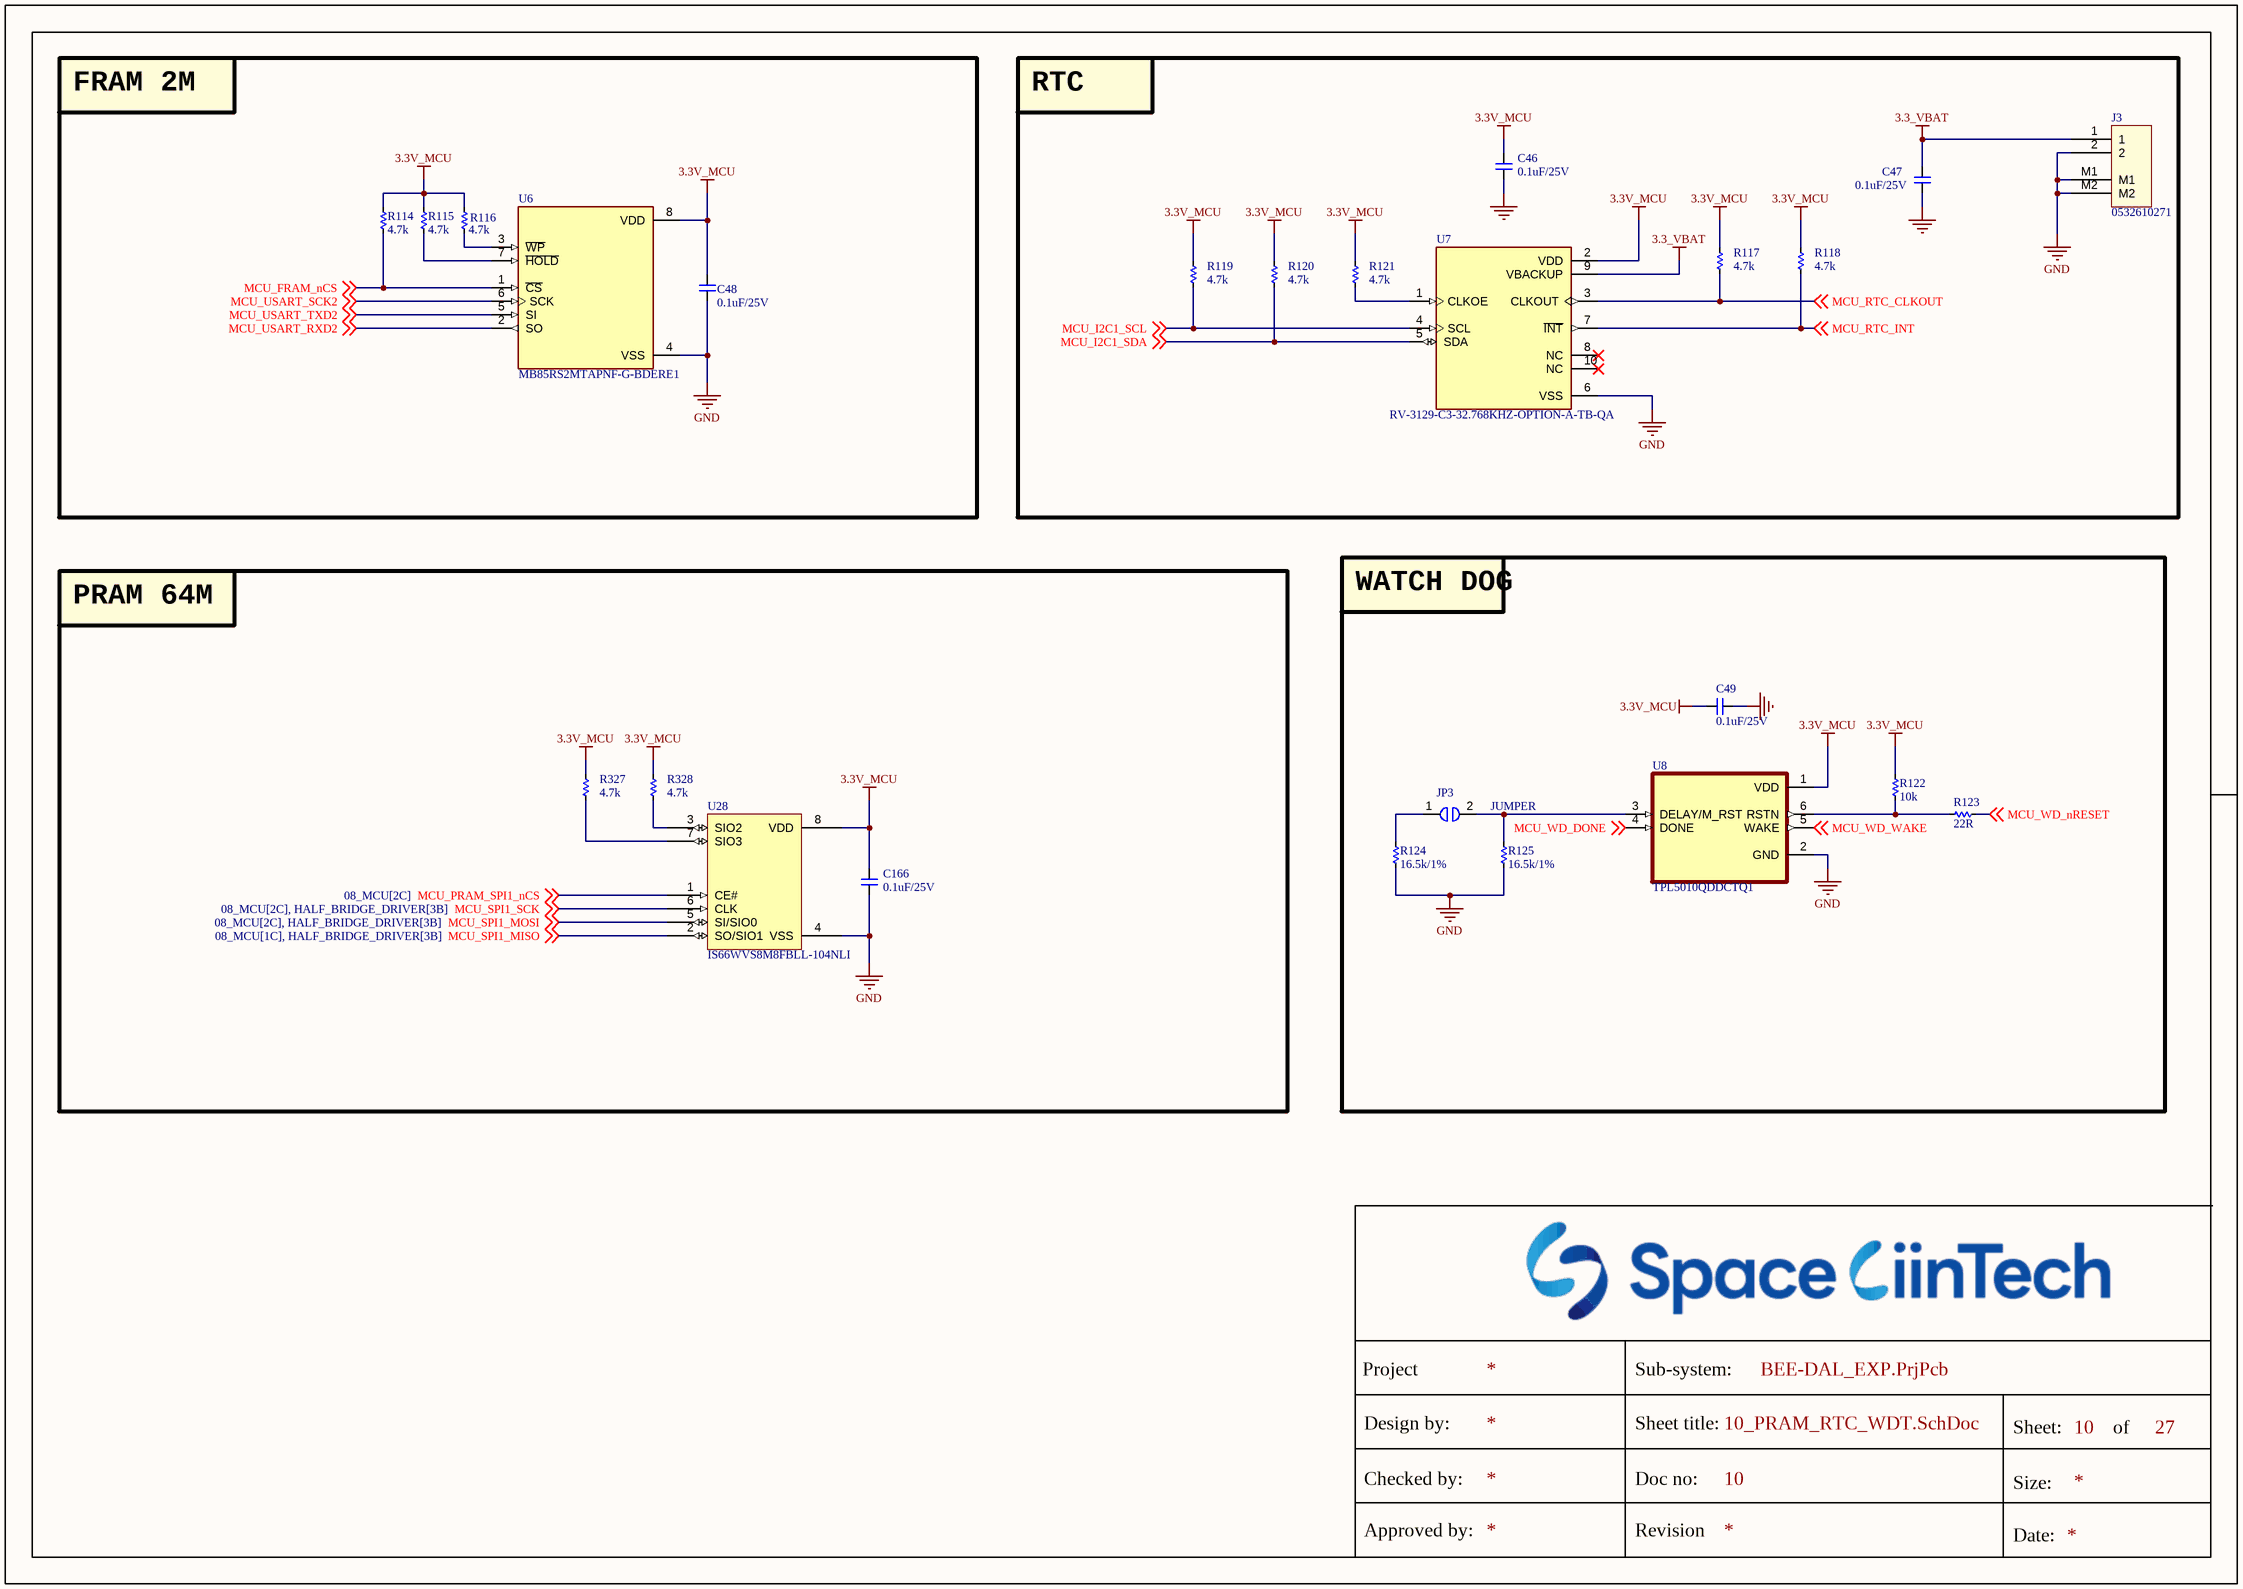
[diagram p7: 10_PRAM_RTC_WDT.SchDoc]

### Parts
(Parts that share a designator on the sheet are numbered #1, #2 ... from top to bottom, then left to right.)
C46  0.1uF/25V  [CAP_C_1005X60]
C47  0.1uF/25V  [CAP_C_1005X60]
C48  0.1uF/25V  [CAP_C_1005X60]
C49  0.1uF/25V  [CAP_C_1005X60]
C166  0.1uF/25V  [CAP_C_1005X60]
J3  0532610271  [MOLEX_0532610271]
JP3  JUMPER  [JUMPER_1608]
R114  4.7k  [RES_C_1005X40]
R115  4.7k  [RES_C_1005X40]
R116  4.7k  [RES_C_1005X40]
R117  4.7k  [RES_C_1005X40]
R118  4.7k  [RES_C_1005X40]
R119  4.7k  [RES_C_1005X40]
R120  4.7k  [RES_C_1005X40]
R121  4.7k  [RES_C_1005X40]
R122  10k  [RES_C_1005X40]
R123  22R  [RES_C_1005X40]
R124  16.5k/1%  [RES_C_1005X40]
R125  16.5k/1%  [RES_C_1005X40]
R327  4.7k  [RES_C_1005X40]
R328  4.7k  [RES_C_1005X40]
U6  MB85RS2MTAPNF-G-BDERE1  [SOIC127P602X173-8N]
U7  RV-3129-C3-32.768KHZ-OPTION-A-TB-QA  [IC_RV-3129-C3_32.768KHZ_OPTION_A_TB_QA]
U8  TPL5010QDDCTQ1  [SOT95P280X145-6N]
U28#1  IS66WVS8M8FBLL-104NLI  [SOIC8_150MIL_N_ISI]

### Blocks framed on the sheet
FRAM 2M: C48 R114-R116 U6
RTC: C46 C47 J3 R117-R121 U7
PRAM 64M: C166 R327 R328 U28#1
WATCH DOG: C49 JP3 R122-R125 U8

### Nets
3.3_VBAT: C47.2 J3.1 U7.9(VBACKUP)
3.3V_MCU: C46.2 C48.2 C49.2 C166.1 R114.2 R115.2 R116.2 R117.2 R118.2 R119.2 R120.2 R121.1 R122.2 R327.2 R328.2 U6.8(VDD) U7.2(VDD) U8.1(VDD) U28#1.8(VDD)
GND: C46.1 C47.1 C48.1 C49.1 C166.2 J3.2 J3.M1 J3.M2 R124.1 R125.1 U6.4(VSS) U7.6(VSS) U8.2(GND) U28#1.4(VSS)
MCU_FRAM_nCS: R114.1 U6.1(~{CS}) ; off-sheet MCU_FRAM_nCS
MCU_I2C1_SCL: R119.1 U7.4(SCL) ; off-sheet MCU_I2C1_SCL
MCU_I2C1_SDA: R120.1 U7.5(SDA) ; off-sheet MCU_I2C1_SDA
MCU_PRAM_SPI1_nCS: U28#1.1(CE#) ; off-sheet MCU_PRAM_SPI1_nCS
MCU_RTC_CLKOUT: R117.1 U7.3(CLKOUT) ; off-sheet MCU_RTC_CLKOUT
MCU_RTC_INT: R118.1 U7.7(~{INT}) ; off-sheet MCU_RTC_INT
MCU_SPI1_MISO: U28#1.2(SO/SIO1) ; off-sheet MCU_SPI1_MISO
MCU_SPI1_MOSI: U28#1.5(SI/SIO0) ; off-sheet MCU_SPI1_MOSI
MCU_SPI1_SCK: U28#1.6(CLK) ; off-sheet MCU_SPI1_SCK
MCU_USART_RXD2: U6.2(SO) ; off-sheet MCU_USART_RXD2
MCU_USART_SCK2: U6.6(SCK) ; off-sheet MCU_USART_SCK2
MCU_USART_TXD2: U6.5(SI) ; off-sheet MCU_USART_TXD2
MCU_WD_DONE: U8.4(DONE) ; off-sheet MCU_WD_DONE
MCU_WD_nRESET: R123.1 ; off-sheet MCU_WD_nRESET
MCU_WD_WAKE: U8.5(WAKE) ; off-sheet MCU_WD_WAKE
NetJP3_1: JP3.1 R124.2
NetJP3_2: JP3.2 R125.2 U8.3(DELAY/M_RST)
NetR115_1: R115.1 U6.7(~{HOLD})
NetR116_1: R116.1 U6.3(~{WP})
NetR121_2: R121.2 U7.1(CLKOE)
NetR122_1: R122.1 R123.2 U8.6(RSTN)
NetR327_1: R327.1 U28#1.7(SIO3)
NetR328_1: R328.1 U28#1.3(SIO2)

Not connected (* = marked no-connect by the designer): U7 8(NC)* 10(NC)*

### Notes on the sheet
- Project
- Sub-system:
- Design by:
- Sheet title:
- Sheet:
- of
- Checked by:
- Approved by:
- Doc no:
- Revision
- Size:
- Date:

### Library data of the parts
C46-C49 C166 = _CAP_C_2: CAP
J3 = Header 2x1_2M
JP3 = JUMPER_1_1
R114-R125 R327 R328 = _RES_B_2: RES
U6 = MB85RS2MTAPNF-G-BDERE1: FRAM _Ferroelectric RAM_ Memory IC 2Mb _256K x 8_ SPI 40MHz 8-SOP; MF: Fujitsu Electronics; Package: SO-8 Fujitsu; Value: *; Digi-Key_Purchase_URL: https://www.digikey.com/product-detail/en/fujitsu-electronics-america-inc/MB85RS2MTAPNF-G-BDERE1/865-1286-1-ND/7916252?utm_source=snapeda&utm_medium=aggregator&utm_campaign=symbol; Digi-Key_Part_Number: 865-1286-1-ND; SnapEDA_Link: https://www.snapeda.com/parts/MB85RS2MTAPNF-G-BDERE1/Fujitsu%20Electronics%20America%2C%20Inc./view-part/2344795/?ref=snap; MP: MB85RS2MTAPNF-G-BDERE1
U7 = RV-3129-C3_32.768KHZ_OPTION_A_TB_QA: Real-Time Clock Module, Temperature compensated, in 2.5 x 3.7 mm package; MF: Micro Crystal; MP: RV-3129-C3 32.768KHZ OPTION A TB QA; SnapEDA_Link: https://www.snapeda.com/parts/RV-3129-C3%2032.768KHZ%20OPTION%20A%20TB%20QA/Micro+Crystal/view-part/?ref=snap; Package: QFN-10 Micro Crystal; Value: *; Check_prices: https://www.snapeda.com/parts/RV-3129-C3%2032.768KHZ%20OPTION%20A%20TB%20QA/Micro+Crystal/view-part/?ref=eda
U28#1 = IS66WVS4M8BLL-104NLI: No Description Available; Manufacturer_Name: ISSI; Type: Memory; Copyright: Copyright (C) 2025 Ultra Librarian. All rights reserved.; Manufacturer_Part_Number: IS66WVS4M8BLL-104NLI; RefDes: RefDes
U8 = TPL5010QDDCTQ1: Package: None; Price: None; Value: *; MP: TPL5010QDDCTQ1; Availability: Unavailable

## Sheet 13_FLOW_Sensor.SchDoc
size 420 x 297 mm; SheetNumber: 13; SheetTotal: 27
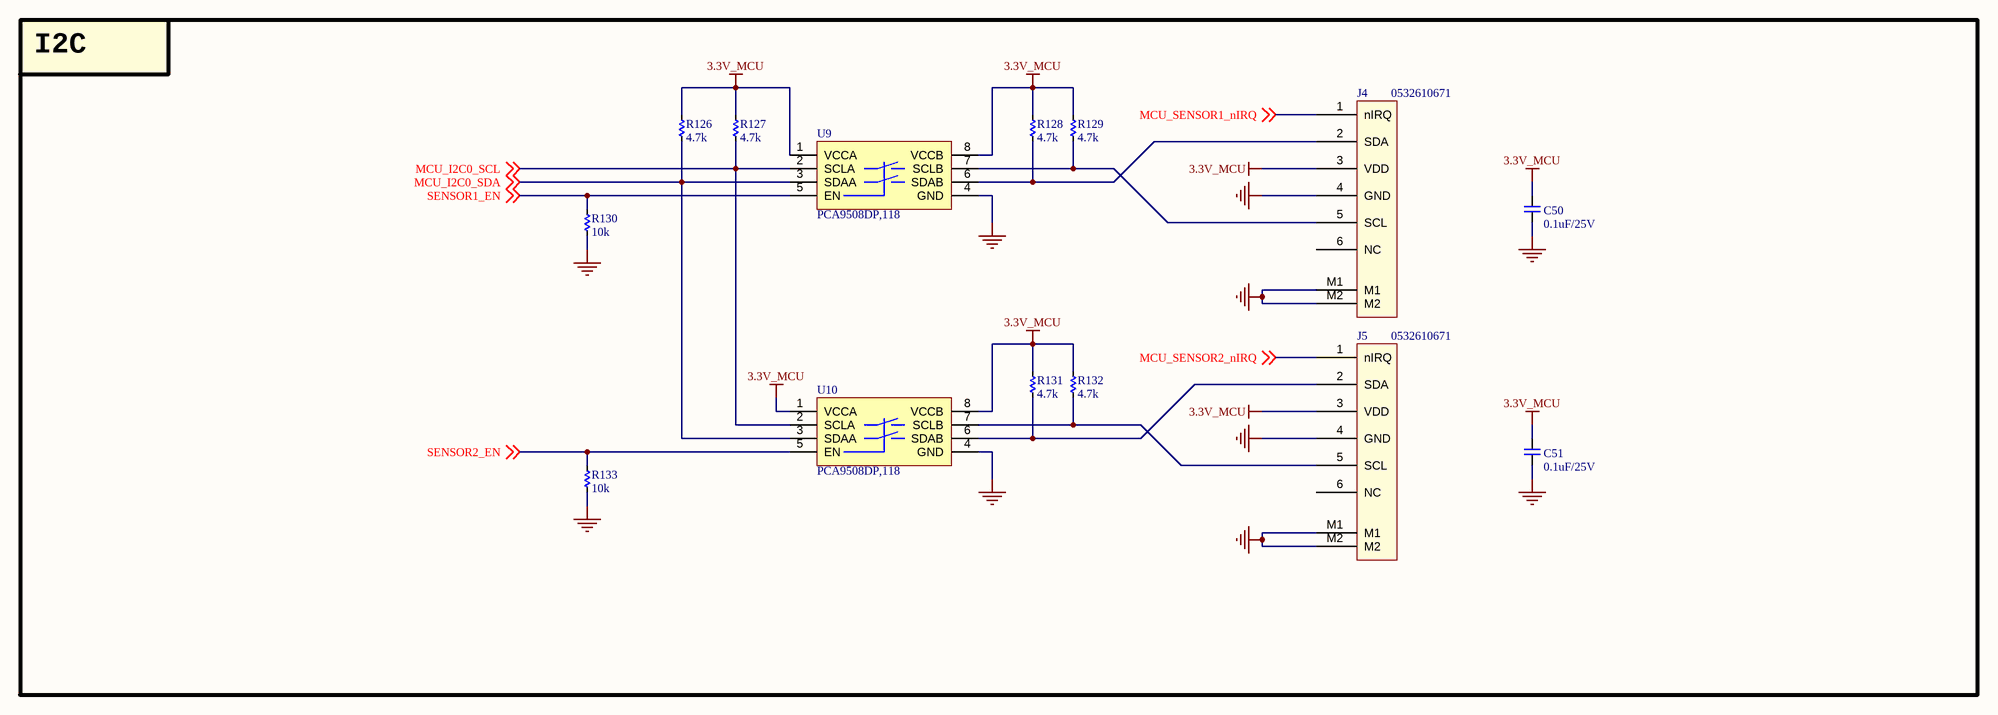
[diagram p8: 13_FLOW_Sensor.SchDoc]

### Parts
C50  0.1uF/25V  [CAP_C_1005X60]
C51  0.1uF/25V  [CAP_C_1005X60]
J4  0532610671  [MOLEX_0532610671]
J5  0532610671  [MOLEX_0532610671]
R126  4.7k  [RES_C_1005X40]
R127  4.7k  [RES_C_1005X40]
R128  4.7k  [RES_C_1005X40]
R129  4.7k  [RES_C_1005X40]
R130  10k  [RES_C_1005X40]
R131  4.7k  [RES_C_1005X40]
R132  4.7k  [RES_C_1005X40]
R133  10k  [RES_C_1005X40]
U9  PCA9508DP,118  [TSOP8]
U10  PCA9508DP,118  [TSOP8]

### Blocks framed on the sheet
I2C: C50 C51 J4 J5 R126-R133 U9 U10

### Nets
3.3V_MCU: C50.2 C51.2 J4.3(VDD) J5.3(VDD) R126.1 R127.1 R128.1 R129.1 R131.1 R132.1 U9.1(VCCA) U9.8(VCCB) U10.1(VCCA) U10.8(VCCB)
GND: C50.1 C51.1 J4.4(GND) J4.M1 J4.M2 J5.4(GND) J5.M1 J5.M2 R130.2 R133.2 U9.4(GND) U10.4(GND)
MCU_I2C0_SCL: R127.2 U9.2(SCLA) U10.2(SCLA) ; off-sheet MCU_I2C0_SCL
MCU_I2C0_SDA: R126.2 U9.3(SDAA) U10.3(SDAA) ; off-sheet MCU_I2C0_SDA
MCU_SENSOR1_nIRQ: J4.1(nIRQ) ; off-sheet MCU_SENSOR1_nIRQ
MCU_SENSOR2_nIRQ: J5.1(nIRQ) ; off-sheet MCU_SENSOR2_nIRQ
SENSOR1_EN: R130.1 U9.5(EN) ; off-sheet SENSOR1_EN
SENSOR2_EN: R133.1 U10.5(EN) ; off-sheet SENSOR2_EN
NetJ4_2: J4.2(SDA) R128.2 U9.6(SDAB)
NetJ4_5: J4.5(SCL) R129.2 U9.7(SCLB)
NetJ5_2: J5.2(SDA) R131.2 U10.6(SDAB)
NetJ5_5: J5.5(SCL) R132.2 U10.7(SCLB)

Not connected (* = marked no-connect by the designer): J4 6(NC); J5 6(NC)

### Notes on the sheet
- Project
- Sub-system:
- Design by:
- Sheet title:
- Sheet:
- of
- Checked by:
- Approved by:
- Doc no:
- Revision
- Size:
- Date:

### Library data of the parts
C50 C51 = _CAP_C_2: CAP
J4 J5 = FLOW_SENSOR
R126-R133 = _RES_B_2: RES

## Sheet 14_I2C_Sensor_OnBoard.SchDoc
size 420 x 297 mm; SheetNumber: 14; SheetTotal: 27
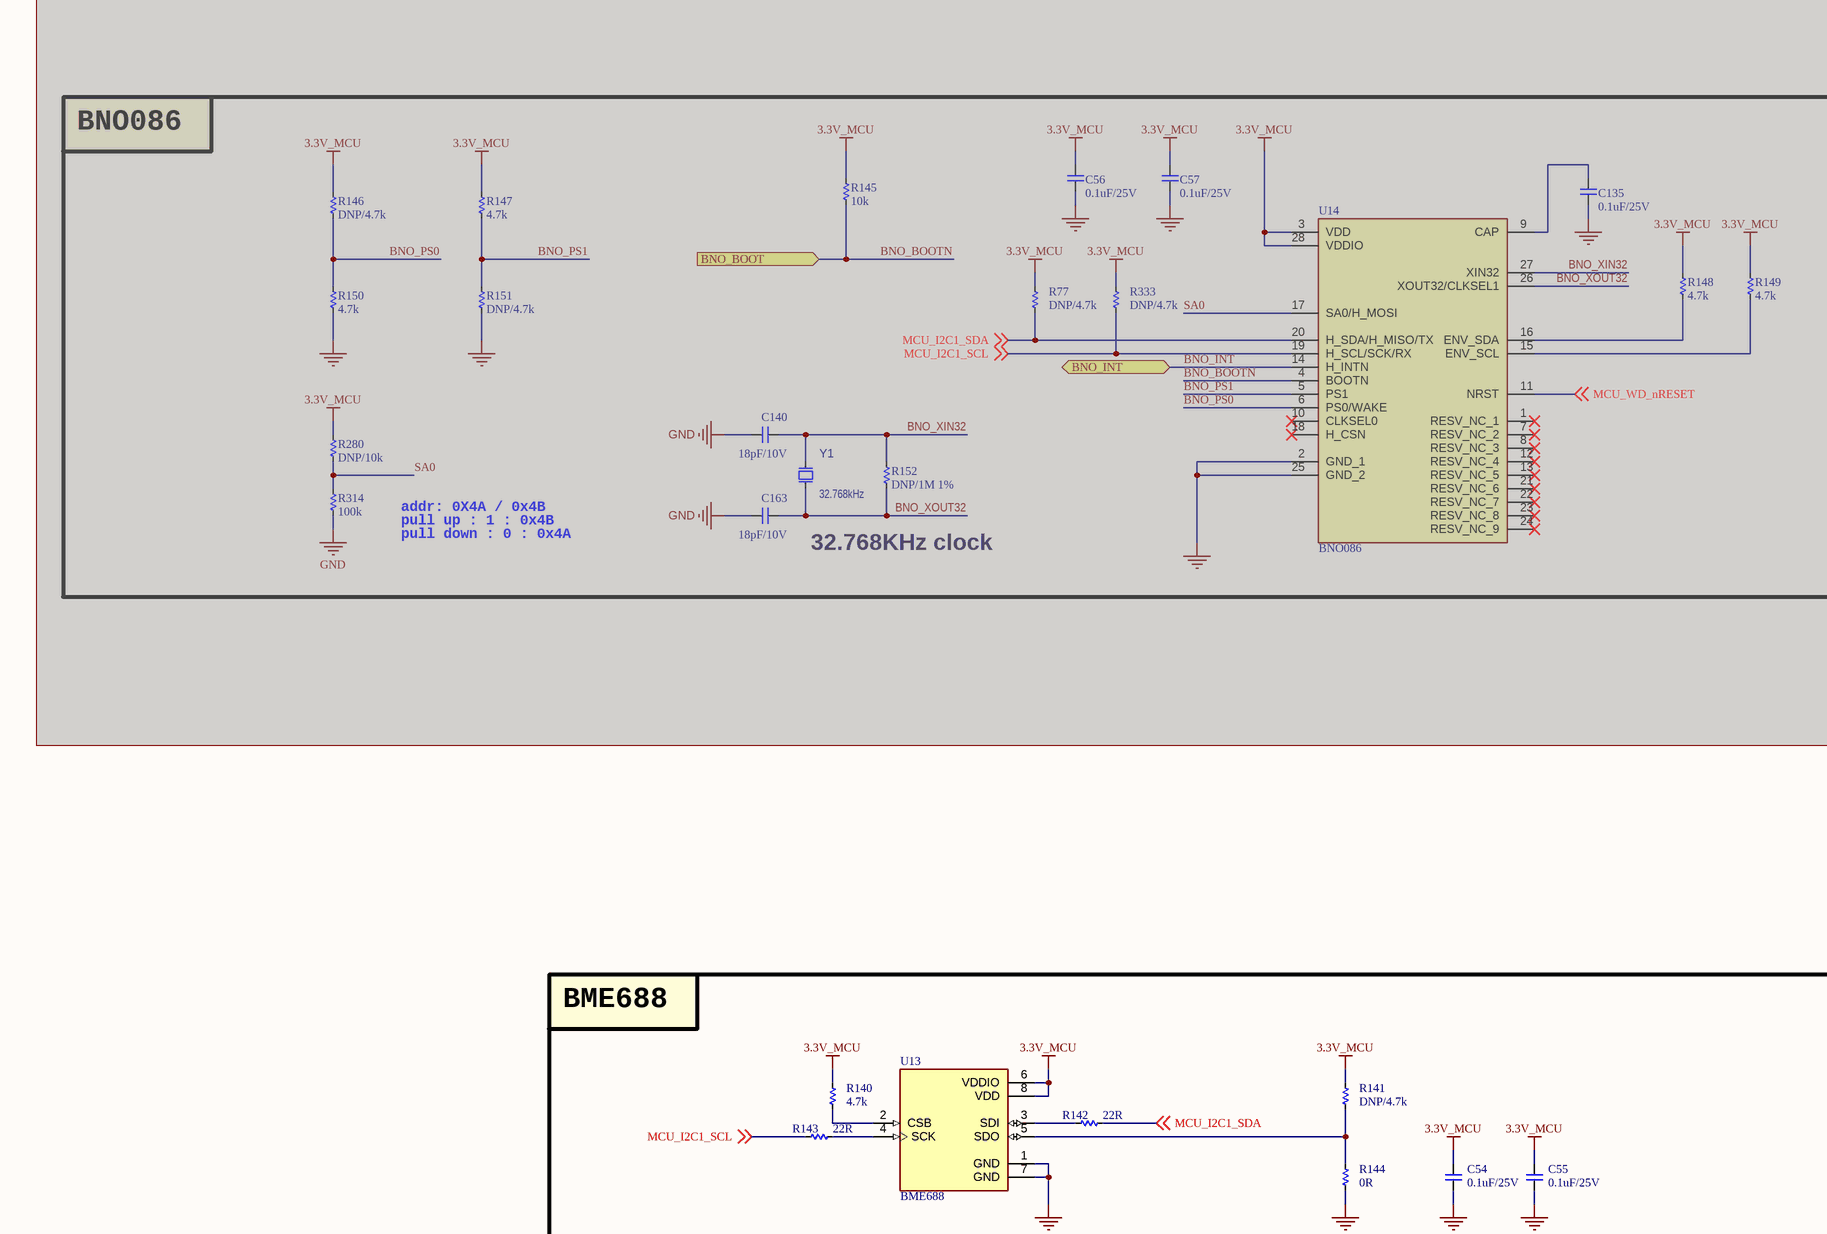
[diagram p9: 14_I2C_Sensor_OnBoard.SchDoc, top left]
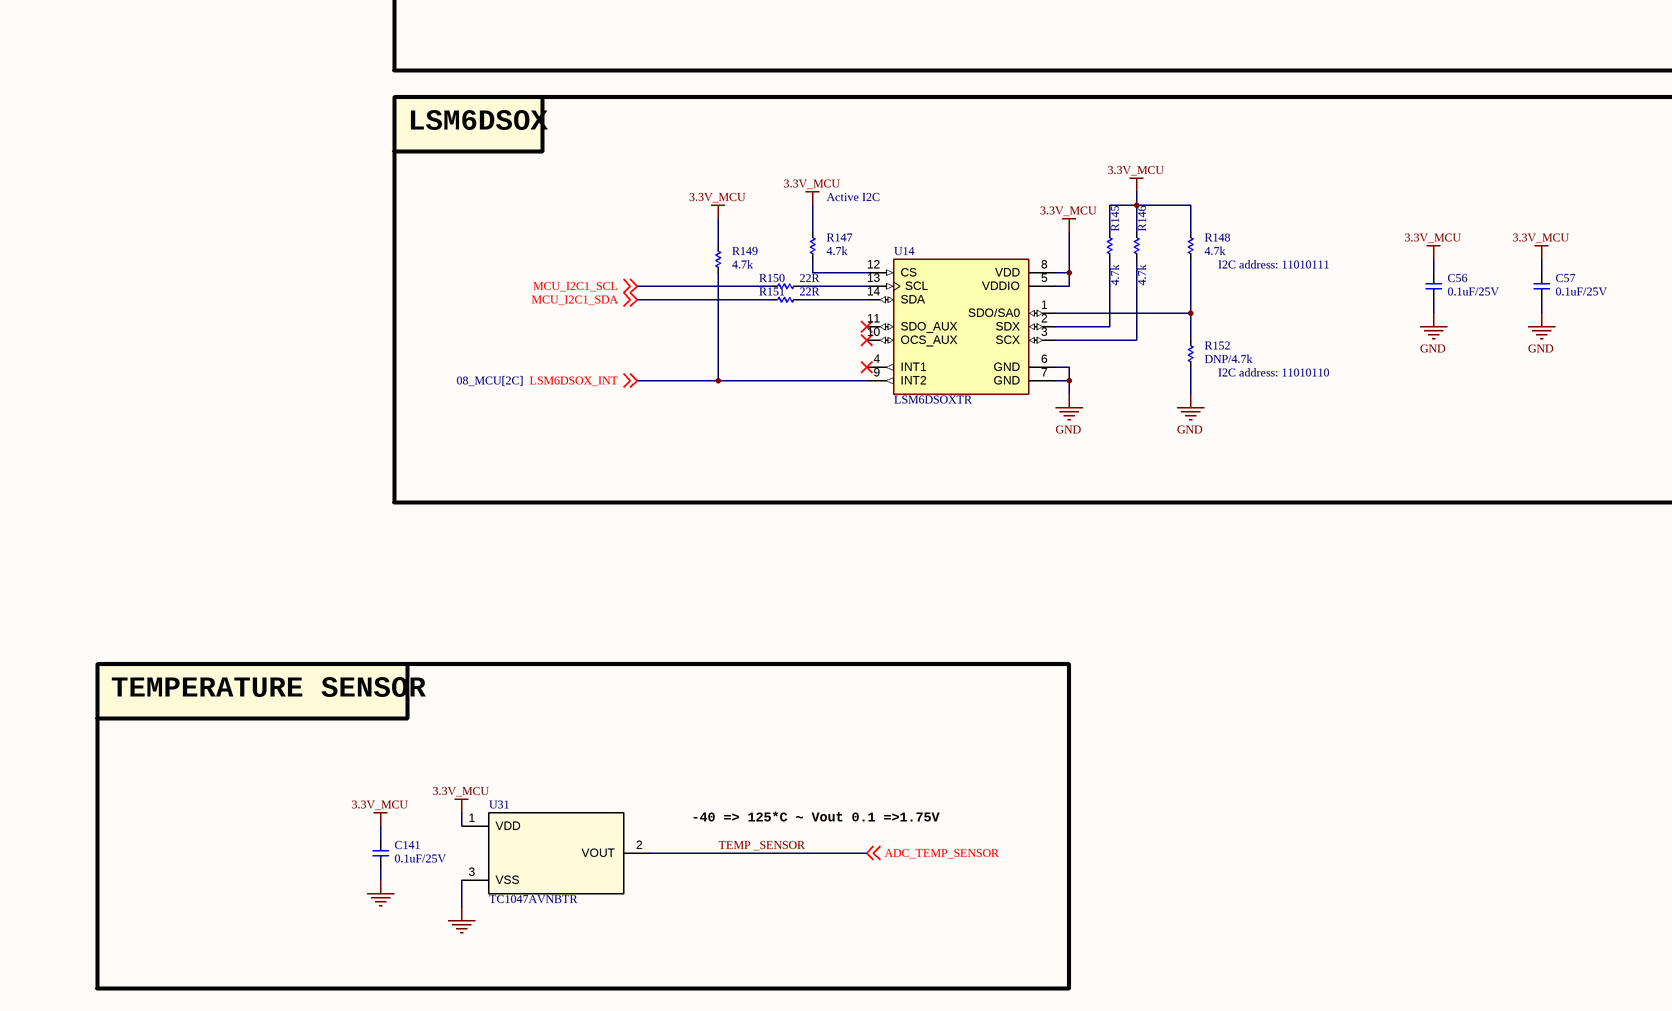
[diagram p10: 14_I2C_Sensor_OnBoard.SchDoc, bottom left]

### Parts
(Parts that share a designator on the sheet are numbered #1, #2 ... from top to bottom, then left to right.)
C54  0.1uF/25V  [CAP_C_1005X60]
C55  0.1uF/25V  [CAP_C_1005X60]
C56#1  0.1uF/25V  [CAP_C_1005X60]  (masked out: inside a compile mask, not in the netlist)
C56#2  0.1uF/25V  [CAP_C_1005X60]
C57#1  0.1uF/25V  [CAP_C_1005X60]  (masked out: inside a compile mask, not in the netlist)
C57#2  0.1uF/25V  [CAP_C_1005X60]
C135#1  0.1uF/25V  [CAP_C_1005X60]  (masked out: inside a compile mask, not in the netlist)
C140#2  18pF/10V  [CAP_C_1005X60]  (masked out: inside a compile mask, not in the netlist)
C141  0.1uF/25V  [CAP_C_1005X60]
C163  18pF/10V  [CAP_C_1005X60]  (masked out: inside a compile mask, not in the netlist)
R77#2  DNP/4.7k  [RES_C_1005X40]  (masked out: inside a compile mask, not in the netlist)
R140  4.7k  [RES_C_1005X40]
R141  DNP/4.7k  [RES_C_1005X40]
R142  22R  [RES_C_1005X40]
R143  22R  [RES_C_1005X40]
R144  0R  [RES_C_1005X40]
R145#1  10k  [RES_C_1005X40]  (masked out: inside a compile mask, not in the netlist)
R145#2  4.7k  [RES_C_1005X40]
R146#1  DNP/4.7k  [RES_C_1005X40]  (masked out: inside a compile mask, not in the netlist)
R146#2  4.7k  [RES_C_1005X40]
R147#1  4.7k  [RES_C_1005X40]  (masked out: inside a compile mask, not in the netlist)
R147#2  4.7k  [RES_C_1005X40]
R148#1  4.7k  [RES_C_1005X40]  (masked out: inside a compile mask, not in the netlist)
R148#2  4.7k  [RES_C_1005X40]
R149#1  4.7k  [RES_C_1005X40]  (masked out: inside a compile mask, not in the netlist)
R149#2  4.7k  [RES_C_1005X40]
R150#1  4.7k  [RES_C_1005X40]  (masked out: inside a compile mask, not in the netlist)
R150#2  22R  [RES_C_1005X40]
R151#1  DNP/4.7k  [RES_C_1005X40]  (masked out: inside a compile mask, not in the netlist)
R151#2  22R  [RES_C_1005X40]
R152#1  DNP/1M 1%  [RES_C_1005X40]  (masked out: inside a compile mask, not in the netlist)
R152#2  DNP/4.7k  [RES_C_1005X40]
R280#1  DNP/10k  [RES_C_1005X40]  (masked out: inside a compile mask, not in the netlist)
R314  100k  [RES_C_1005X40]  (masked out: inside a compile mask, not in the netlist)
R333  DNP/4.7k  [RES_C_1005X40]  (masked out: inside a compile mask, not in the netlist)
U13  BME688  [IC_BME688]
U14#1  BNO086  [BNO086]  (masked out: inside a compile mask, not in the netlist)
U14#2  LSM6DSOXTR  [PQFN50P250X300X86-14N]
U31  TC1047AVNBTR  [SOT95P240X120-3N]
Y1  value 32.768kHz  [CRYSTAL_NX2012SA]  (hidden comment: Crystal 2 Pins)  (masked out: inside a compile mask, not in the netlist)

### Blocks framed on the sheet
BNO086: C56#1 C57#1 C135#1 C140#2 C163 R77#2 R145#1 R146#1 R147#1 R148#1 R149#1 R150#1 R151#1 R152#1 R280#1 R314 R333 U14#1 Y1
BME688: C54 C55 R140-R144 U13
LSM6DSOX: C56#2 C57#2 R145#2 R146#2 R147#2 R148#2 R149#2 R150#2 R151#2 R152#2 U14#2
TEMPERATURE SENSOR: C141 U31

### Ports
BNO_BOOT (in), BNO_INT (bidir)

### Nets
3.3V_MCU: C54.2 C55.2 C56#2.2 C57#2.2 C141.2 R140.1 R141.1 R145#2.1 R146#2.1 R147#2.1 R148#2.1 R149#2.1 U13.6(VDDIO) U13.8(VDD) U14#2.5(VDDIO) U14#2.8(VDD) U31.1(VDD)
GND: C54.1 C55.1 C56#2.1 C57#2.1 C141.1 R144.2 R152#2.2 U13.1(GND) U13.7(GND) U14#2.6(GND) U14#2.7(GND) U31.3(VSS)
LSM6DSOX_INT: R149#2.2 U14#2.9(INT2) ; off-sheet LSM6DSOX_INT
MCU_I2C1_SCL: R143.1 R150#2.1 ; off-sheet MCU_I2C1_SCL
MCU_I2C1_SDA: R142.2 R151#2.1 ; off-sheet MCU_I2C1_SDA
TEMP _SENSOR: U31.2(VOUT) ; off-sheet ADC_TEMP_SENSOR  [also labelled ADC_TEMP_SENSOR]
NetR140_2: R140.2 U13.2(CSB)
NetR141_2: R141.2 R144.1 U13.5(SDO)
NetR142_1: R142.1 U13.3(SDI)
NetR143_2: R143.2 U13.4(SCK)
NetR145#2_2: R145#2.2 U14#2.2(SDX)
NetR146#2_2: R146#2.2 U14#2.3(SCX)
NetR147#2_2: R147#2.2 U14#2.12(CS)
NetR148#2_2: R148#2.2 R152#2.1 U14#2.1(SDO/SA0)
NetR150#2_2: R150#2.2 U14#2.13(SCL)
NetR151#2_2: R151#2.2 U14#2.14(SDA)

Not connected (* = marked no-connect by the designer): U14#2 4(INT1)* 10(OCS_AUX)* 11(SDO_AUX)*

### Notes on the sheet
- addr: 0X4A / 0x4B
- pull up : 1 : 0x4B
- pull down : 0 : 0x4A
- 32.768KHz clock
- (near R147#2) Active I2C
- (near R148#2) I2C address: 11010111
- (near R152#2) I2C address: 11010110
- -40 => 125*C ~ Vout 0.1 =>1.75V
- Project
- Sub-system:
- Design by:
- Sheet title:
- Sheet:
- of
- Checked by:
- Approved by:
- Doc no:
- Revision
- Size:
- Date:

### Library data of the parts
C54 C55 C56#1 C56#2 C57#1 C57#2 C135#1 C140#2 C141 C163 = _CAP_C_2: CAP
R77#2 R140-R144 R145#1 R145#2 R146#1 R146#2 R147#1 R147#2 R148#1 R148#2 R149#1 R149#2 R150#1 R150#2 R151#1 R151#2 R152#1 R152#2 R280#1 R314 R333 = _RES_B_2: RES
U13 = BME688: Gas sensor measuring relative humidity, barometric pressure, ambient temperature and gas (VOC); Package: None; MP: BME688; Price: None; Availability: Unavailable; Value: *
U14#1 = BNO086: Accelerometer, Gyroscope, Magnetometer, Temperature, 9 Axis Sensor IC, SPI Output; Manufacturer_Name: CEVA; Geometry.Height: 1.18mm; Mouser Part Number: 526-BNO086; Mouser Price/Stock: https://www.mouser.co.uk/ProductDetail/CEVA/BNO086?qs=ulEaXIWI0c%2FqTo1scjodAw%3D%3D; Manufacturer_Part_Number: BNO086; Datasheet Link: *
U14#2 = LSM6DSOXTR: Accelerometer, Gyroscope, 6 Axis Sensor I2C, SPI Output; MF: STMicroelectronics; SnapEDA_Link: https://www.snapeda.com/parts/LSM6DSOXTR/STMicroelectronics/view-part/?ref=snap; Package: VFLGA-14 STMicroelectronics; Value: *; MP: LSM6DSOXTR; Check_prices: https://www.snapeda.com/parts/LSM6DSOXTR/STMicroelectronics/view-part/?ref=eda
U31 = IC_SENSOR_TC1047AVNBTR: Temperature Sensor Analog, Local -40°C ~ 125°C 10mV/°C SOT-23-3
Y1 = OSC_32.768kHz: Crystal; Manufacturer 1: NDK; Manufacturer Part Number 1: NX2012SA-32.768K-STD-MUB-1; MCHP-ID: OSC1092; Description_: CRYSTAL 32.768kHz 12.5pF SMD NX2012SA; Dev Tools Status: Production; Owner: Jamus Griego; Tolerance: ±20ppm; Load Capacitance: 12.5pF; Populated: YES; Revision: 1; Symbol: Crystal 2 Pins; Status: MCL Design; ComponentLink1URL: https://chn-vm-apps.microchip.com/mchprepo/parts/Datasheets/c_NX2012SA-STD-MUB-1_e.pdf; ComponentLink1Description: SVN Datasheet; ComponentLink2URL: C:\ALTIUM_WORK\00001_MCHP-CDB\Datasheets\c_NX2012SA-STD-MUB-1_e.pdf; ComponentLink2Description: Local Datasheet; ComponentLink3URL: C:\ALTIUM_WORK\00001_MCHP-CDB\Library\LibraryRefs\Crystal 2 Pins.SchLib; ComponentLink3Description: Open Symbol; ComponentLink4URL: C:\ALTIUM_WORK\00001_MCHP-CDB\Library\Footprints\CRYSTAL_NX2012SA.PcbLib; ComponentLink4Description: Open Footprint; ComponentLink5Description: Open Footprint 2; ComponentLink6Description: Open Footprint 3; ComponentLink7Description: Open Footprint 4; Type: Crystal; Category: Crystal/Oscillator; Supplier 1: Digi-Key; Supplier Part Number 1: 644-1219-1-ND; Quantity Override: 1

## Sheet 15_HD_PUMP.SchDoc
size 420 x 297 mm; SheetNumber: 15; SheetTotal: 27
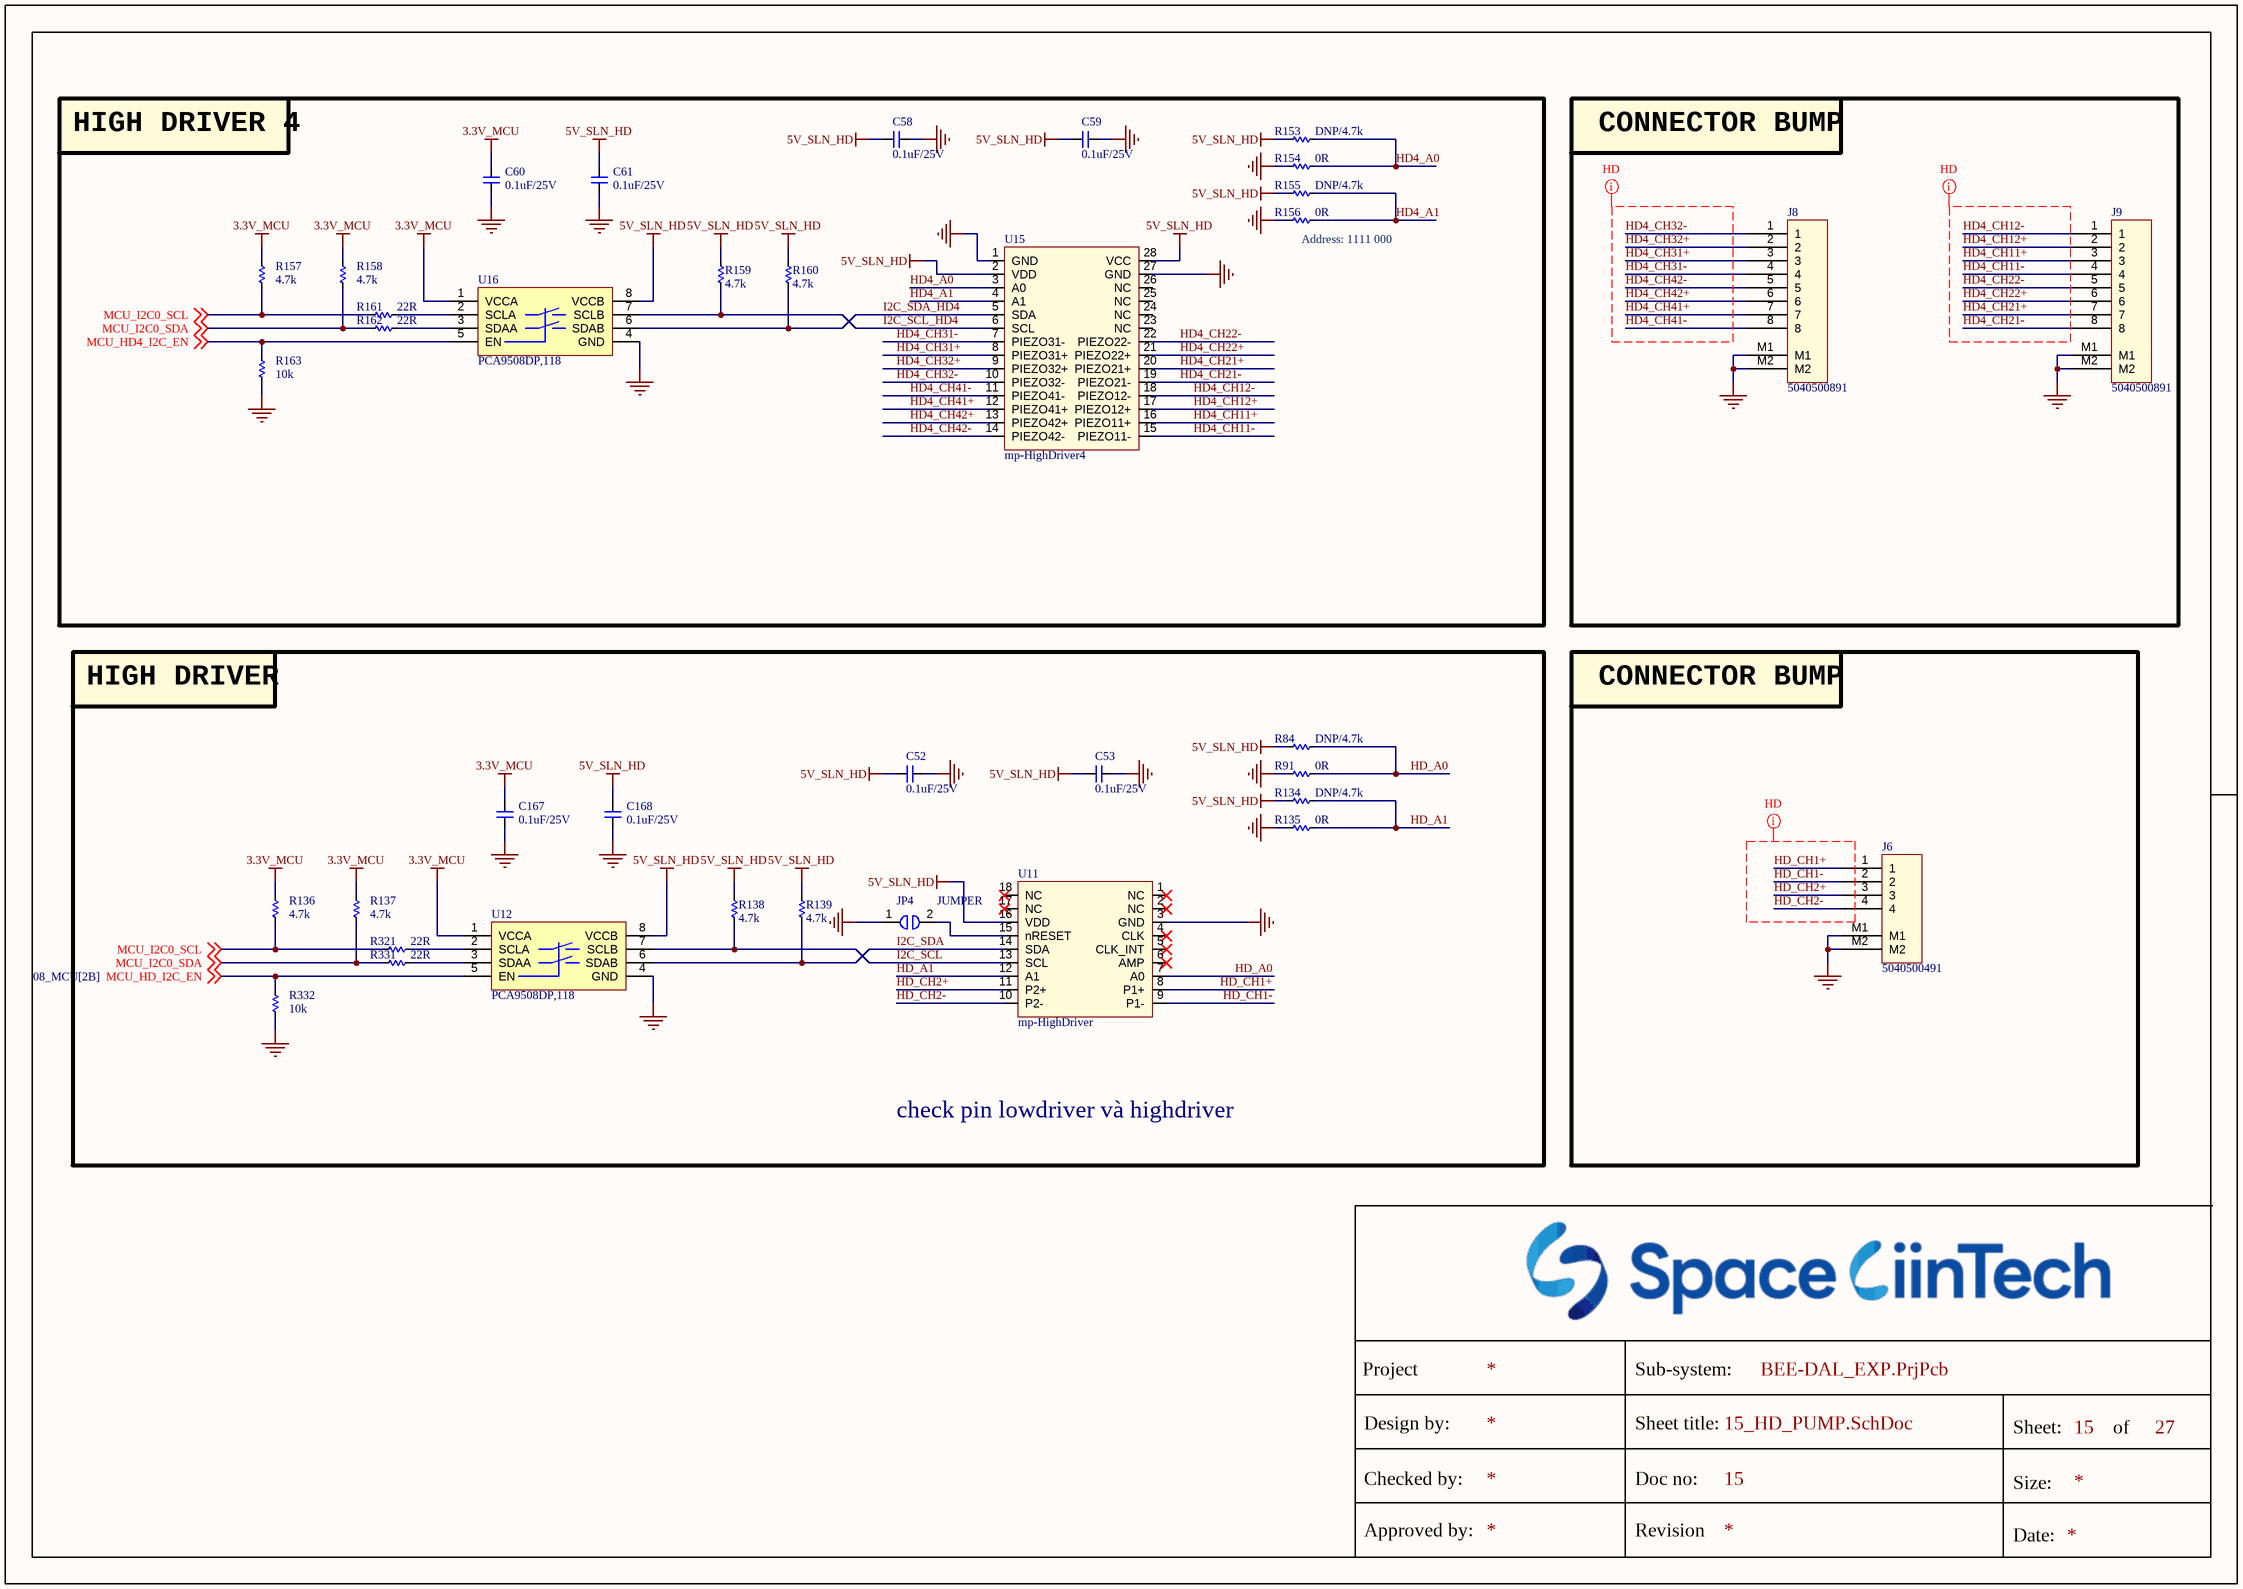
[diagram p11: 15_HD_PUMP.SchDoc]

### Parts
C52  0.1uF/25V  [CAP_C_1005X60]
C53  0.1uF/25V  [CAP_C_1005X60]
C58  0.1uF/25V  [CAP_C_1005X60]
C59  0.1uF/25V  [CAP_C_1005X60]
C60  0.1uF/25V  [CAP_C_1005X60]
C61  0.1uF/25V  [CAP_C_1005X60]
C167  0.1uF/25V  [CAP_C_1005X60]
C168  0.1uF/25V  [CAP_C_1005X60]
J6  5040500491  [MOLEX_5040500491]
J8  5040500891  [MOLEX_5040500891]
J9  5040500891  [MOLEX_5040500891]
JP4  JUMPER  [JUMPER_1608]
R84  DNP/4.7k  [RES_C_1005X40]
R91  0R  [RES_C_1005X40]
R134  DNP/4.7k  [RES_C_1005X40]
R135  0R  [RES_C_1005X40]
R136  4.7k  [RES_C_1005X40]
R137  4.7k  [RES_C_1005X40]
R138  4.7k  [RES_C_1005X40]
R139  4.7k  [RES_C_1005X40]
R153  DNP/4.7k  [RES_C_1005X40]
R154  0R  [RES_C_1005X40]
R155  DNP/4.7k  [RES_C_1005X40]
R156  0R  [RES_C_1005X40]
R157  4.7k  [RES_C_1005X40]
R158  4.7k  [RES_C_1005X40]
R159  4.7k  [RES_C_1005X40]
R160  4.7k  [RES_C_1005X40]
R161  22R  [RES_C_1005X40]
R162  22R  [RES_C_1005X40]
R163  10k  [RES_C_1005X40]
R321  22R  [RES_C_1005X40]
R331  22R  [RES_C_1005X40]
R332  10k  [RES_C_1005X40]
U11  mp-HighDriver  [MP_HIGHDRIVER]
U12  PCA9508DP,118  [TSOP8]
U15  mp-HighDriver4  [MP_HIGHDRIVER4]
U16  PCA9508DP,118  [TSOP8]

### Blocks framed on the sheet
HIGH DRIVER 4: C58-C61 R153-R163 U15 U16
CONNECTOR BUMP: J8 J9
HIGH DRIVER: C52 C53 C167 C168 JP4 R84 R91 R134-R139 R321 R331 R332 U11 U12
CONNECTOR BUMP: J6

### Nets
3.3V_MCU: C60.2 C167.2 R136.1 R137.1 R157.1 R158.1 U12.1(VCCA) U16.1(VCCA)
5V_SLN_HD: C52.2 C53.2 C58.2 C59.2 C61.2 C168.2 R84.1 R134.1 R138.1 R139.1 R153.1 R155.1 R159.1 R160.1 U11.16(VDD) U12.8(VCCB) U15.2(VDD) U15.28(VCC) U16.8(VCCB)
GND: C52.1 C53.1 C58.1 C59.1 C60.1 C61.1 C167.1 C168.1 J6.M1 J6.M2 J8.M1 J8.M2 J9.M1 J9.M2 JP4.1 R91.1 R135.1 R154.1 R156.1 R163.2 R332.2 U11.3(GND) U12.4(GND) U15.1(GND) U15.27(GND) U16.4(GND)
HD4_A0: R153.2 R154.2 U15.3(A0)
HD4_A1: R155.2 R156.2 U15.4(A1)
HD4_CH11+: J9.3 U15.16(PIEZO11+)
HD4_CH11-: J9.4 U15.15(PIEZO11-)
HD4_CH12+: J9.2 U15.17(PIEZO12+)
HD4_CH12-: J9.1 U15.18(PIEZO12-)
HD4_CH21+: J9.7 U15.20(PIEZO21+)
HD4_CH21-: J9.8 U15.19(PIEZO21-)
HD4_CH22+: J9.6 U15.21(PIEZO22+)
HD4_CH22-: J9.5 U15.22(PIEZO22-)
HD4_CH31+: J8.3 U15.8(PIEZO31+)
HD4_CH31-: J8.4 U15.7(PIEZO31-)
HD4_CH32+: J8.2 U15.9(PIEZO32+)
HD4_CH32-: J8.1 U15.10(PIEZO32-)
HD4_CH41+: J8.7 U15.12(PIEZO41+)
HD4_CH41-: J8.8 U15.11(PIEZO41-)
HD4_CH42+: J8.6 U15.13(PIEZO42+)
HD4_CH42-: J8.5 U15.14(PIEZO42-)
HD_A0: R84.2 R91.2 U11.7(A0)
HD_A1: R134.2 R135.2 U11.12(A1)
HD_CH1+: J6.1 U11.8(P1+)
HD_CH1-: J6.2 U11.9(P1-)
HD_CH2+: J6.3 U11.11(P2+)
HD_CH2-: J6.4 U11.10(P2-)
I2C_SCL: R138.2 U11.13(SCL) U12.7(SCLB)
I2C_SCL_HD4: R159.2 U15.6(SCL) U16.7(SCLB)
I2C_SDA: R139.2 U11.14(SDA) U12.6(SDAB)
I2C_SDA_HD4: R160.2 U15.5(SDA) U16.6(SDAB)
MCU_HD4_I2C_EN: R163.1 U16.5(EN) ; off-sheet MCU_HD4_I2C_EN
MCU_HD_I2C_EN: R332.1 U12.5(EN) ; off-sheet MCU_HD_I2C_EN
MCU_I2C0_SCL: R136.2 R157.2 R161.1 R321.1 ; off-sheet MCU_I2C0_SCL
MCU_I2C0_SDA: R137.2 R158.2 R162.1 R331.1 ; off-sheet MCU_I2C0_SDA
NetJP4_2: JP4.2 U11.15(nRESET)
NetR161_2: R161.2 U16.2(SCLA)
NetR162_2: R162.2 U16.3(SDAA)
NetR321_2: R321.2 U12.2(SCLA)
NetR331_2: R331.2 U12.3(SDAA)

Not connected (* = marked no-connect by the designer): U11 1(NC)* 2(NC)* 4(CLK)* 5(CLK_INT)* 6(AMP)* 17(NC)* 18(NC)*; U15 23(NC) 24(NC) 25(NC) 26(NC)

### Layout directives
net class HD: HD4_CH11+, HD4_CH11-, HD4_CH12+, HD4_CH12-, HD4_CH21+, HD4_CH21-, HD4_CH22+, HD4_CH22-, HD4_CH31+, HD4_CH31-, HD4_CH32+, HD4_CH32-, HD4_CH41+, HD4_CH41-, HD4_CH42+, HD4_CH42-, HD_CH1+, HD_CH1-, HD_CH2+, HD_CH2-

### Notes on the sheet
- (near R156) Address: 1111 000
- check pin lowdriver và highdriver
- Project
- Sub-system:
- Design by:
- Sheet title:
- Sheet:
- of
- Checked by:
- Approved by:
- Doc no:
- Revision
- Size:
- Date:

### Library data of the parts
C52 C53 C58-C61 C167 C168 = _CAP_C_2: CAP
J6 = Header 4x1_2M
J8 J9 = Header 8x1_2M
JP4 = JUMPER_1_1
R84 R91 R134-R139 R153-R163 R321 R331 R332 = _RES_B_2: RES
U15 = mp_HighDriver4

## Sheet 16_SOLENOID_HB_1.SchDoc
size 420 x 297 mm; SheetNumber: 16; SheetTotal: 27
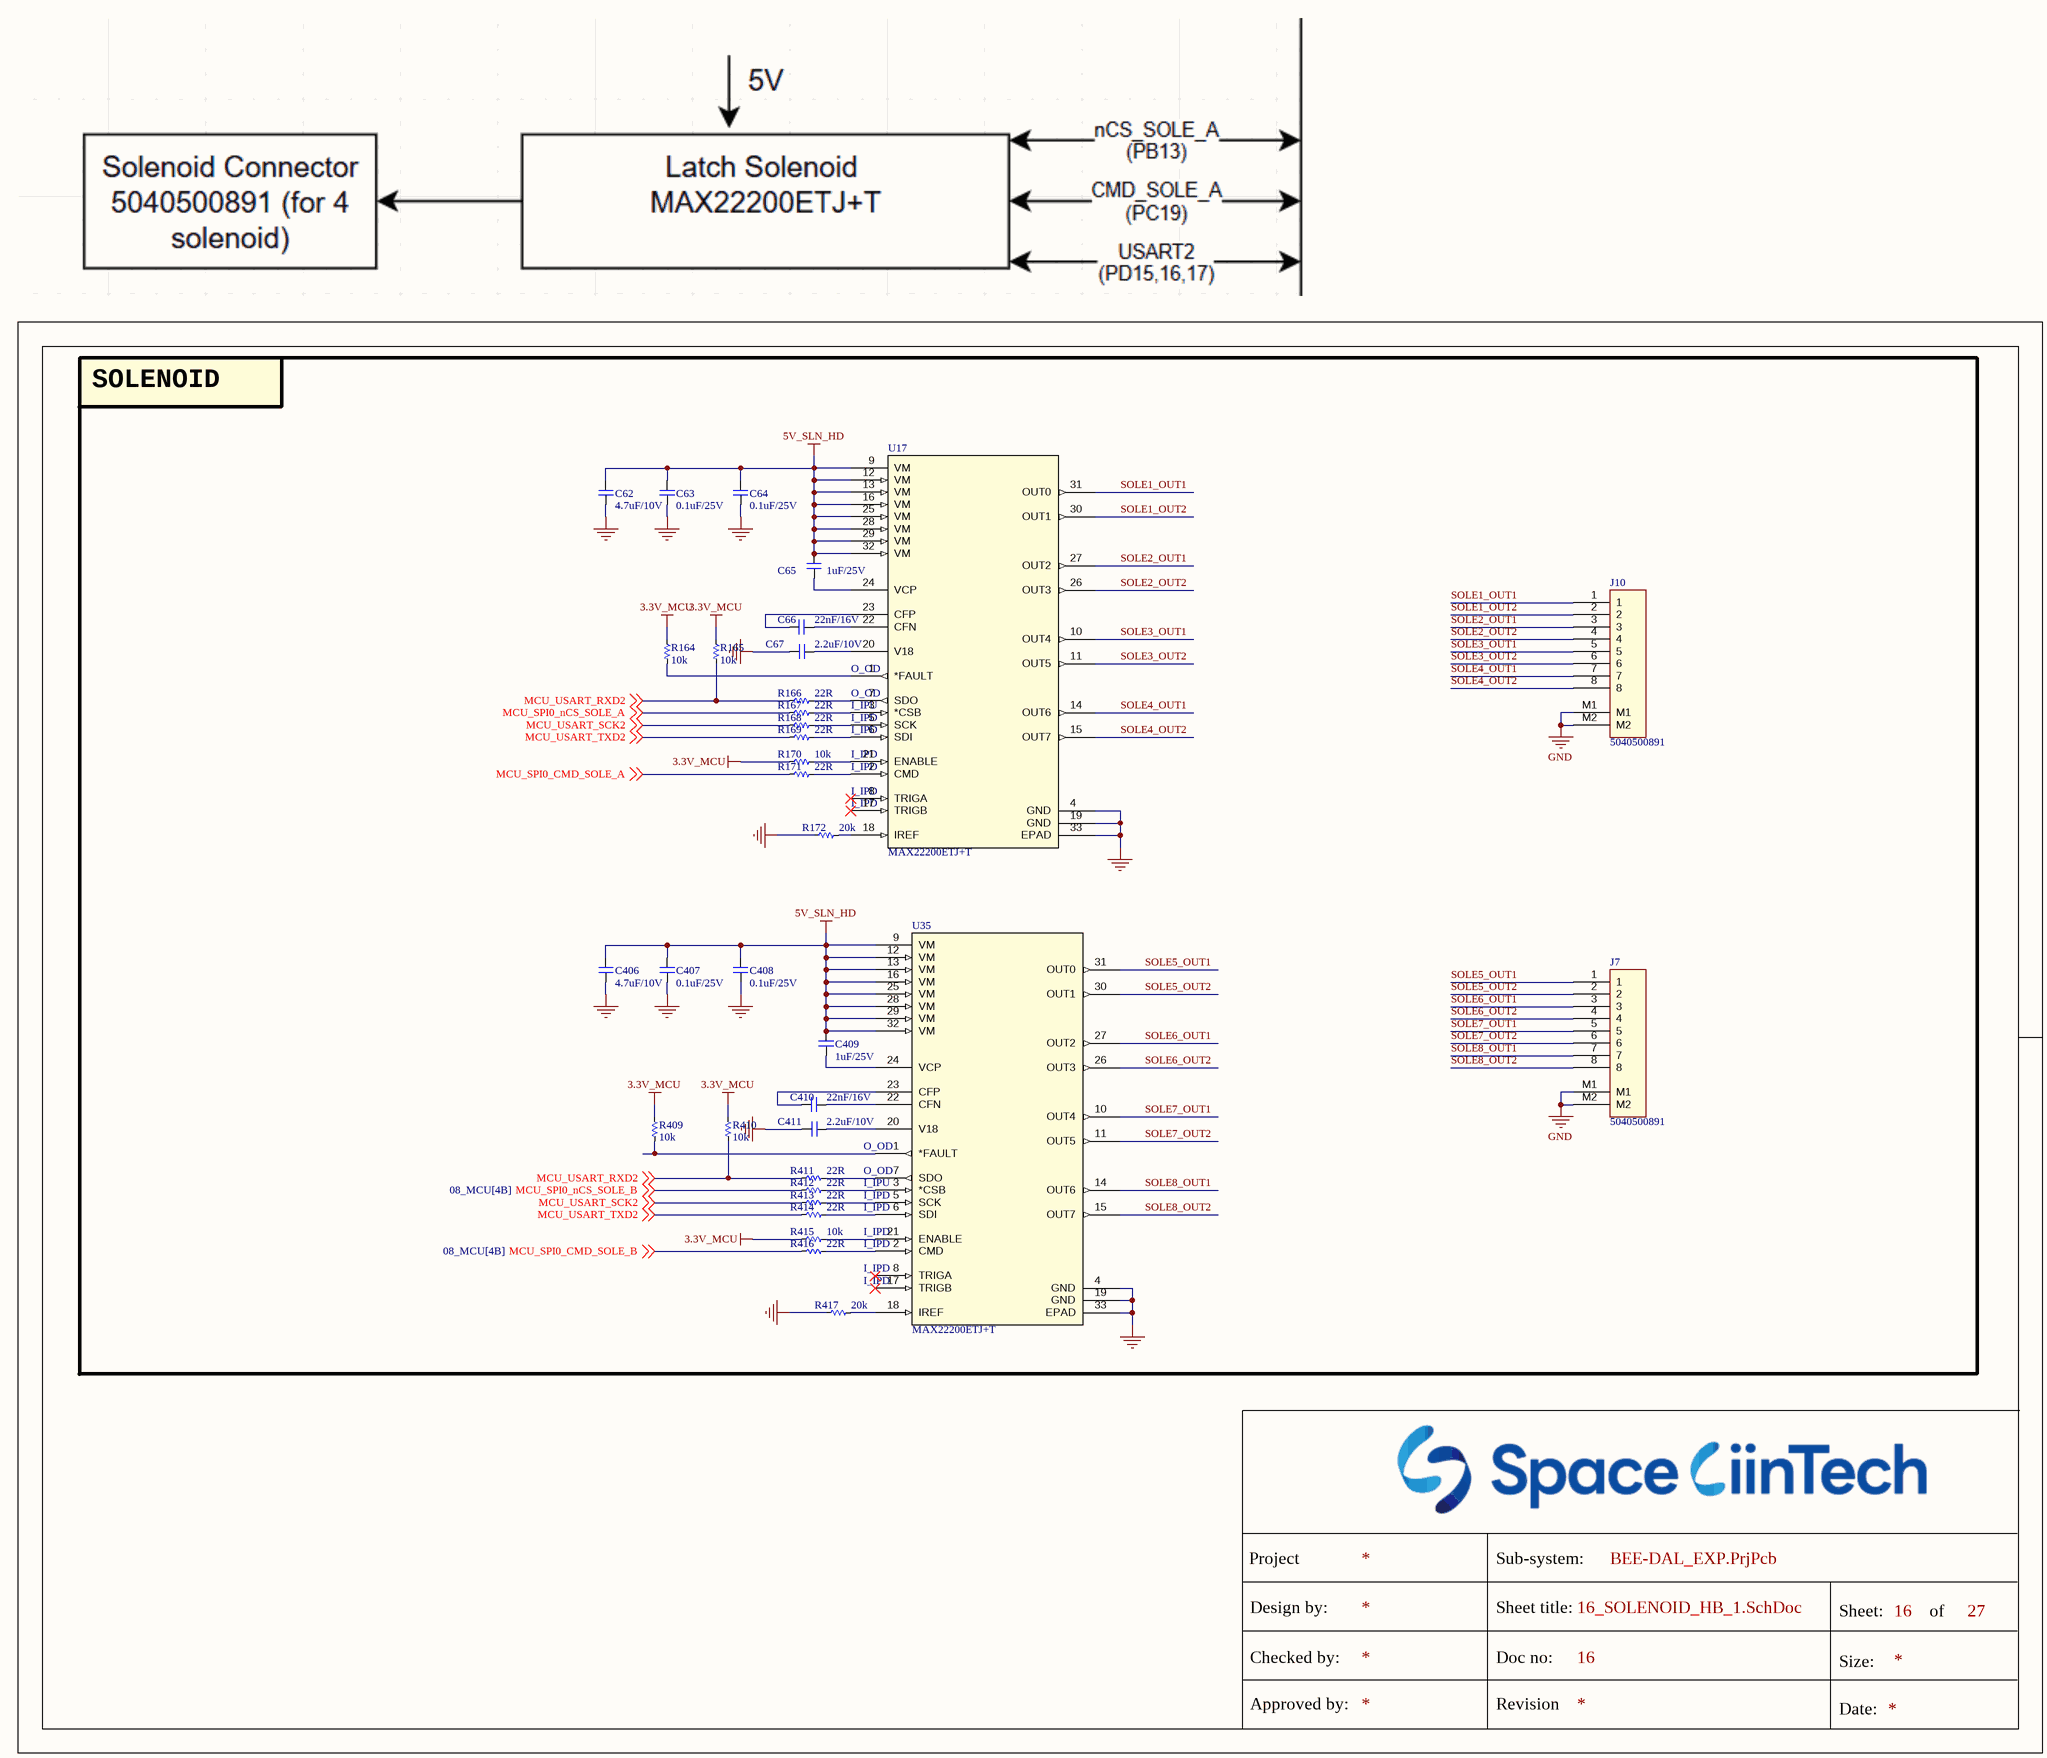
[diagram p12: 16_SOLENOID_HB_1.SchDoc]

### Parts
C62  4.7uF/10V  [CAP_C_1005X60]
C63  0.1uF/25V  [CAP_C_1005X60]
C64  0.1uF/25V  [CAP_C_1005X60]
C65  1uF/25V  [CAP_C_1005X60]
C66  22nF/16V  [CAP_C_1005X60]
C67  2.2uF/10V  [CAP_C_1005X60]
C406  4.7uF/10V  [CAP_C_1005X60]
C407  0.1uF/25V  [CAP_C_1005X60]
C408  0.1uF/25V  [CAP_C_1005X60]
C409  1uF/25V  [CAP_C_1005X60]
C410  22nF/16V  [CAP_C_1005X60]
C411  2.2uF/10V  [CAP_C_1005X60]
J7  5040500891  [MOLEX_5040500891]
J10  5040500891  [MOLEX_5040500891]
R164  10k  [RES_C_1005X40]
R165  10k  [RES_C_1005X40]
R166  22R  [RES_C_1005X40]
R167  22R  [RES_C_1005X40]
R168  22R  [RES_C_1005X40]
R169  22R  [RES_C_1005X40]
R170  10k  [RES_C_1005X40]
R171  22R  [RES_C_1005X40]
R172  20k  [RES_C_1005X40]
R409  10k  [RES_C_1005X40]
R410  10k  [RES_C_1005X40]
R411  22R  [RES_C_1005X40]
R412  22R  [RES_C_1005X40]
R413  22R  [RES_C_1005X40]
R414  22R  [RES_C_1005X40]
R415  10k  [RES_C_1005X40]
R416  22R  [RES_C_1005X40]
R417  20k  [RES_C_1005X40]
U17  MAX22200ETJ+T  [21-0140AK_T3255_8C_MXM]
U35  MAX22200ETJ+T  [21-0140AK_T3255_8C_MXM]

### Nets
3.3V_MCU: R164.1 R165.1 R170.1 R409.1 R410.1 R415.1
5V_SLN_HD: C62.2 C63.2 C64.2 C65.2 C406.2 C407.2 C408.2 C409.2 U17.9(VM) U17.12(VM) U17.13(VM) U17.16(VM) U17.25(VM) U17.28(VM) U17.29(VM) U17.32(VM) U35.9(VM) U35.12(VM) U35.13(VM) U35.16(VM) U35.25(VM) U35.28(VM) U35.29(VM) U35.32(VM)
GND: C62.1 C63.1 C64.1 C67.1 C406.1 C407.1 C408.1 C411.1 J7.M1 J7.M2 J10.M1 J10.M2 R172.1 R417.1 U17.4(GND) U17.19(GND) U17.33(EPAD) U35.4(GND) U35.19(GND) U35.33(EPAD)
MCU_SPI0_CMD_SOLE_A: R171.1 ; off-sheet MCU_SPI0_CMD_SOLE_A
MCU_SPI0_CMD_SOLE_B: R416.1 ; off-sheet MCU_SPI0_CMD_SOLE_B
MCU_SPI0_nCS_SOLE_A: R167.1 ; off-sheet MCU_SPI0_nCS_SOLE_A
MCU_SPI0_nCS_SOLE_B: R412.1 ; off-sheet MCU_SPI0_nCS_SOLE_B
MCU_USART_RXD2: R165.2 R166.1 R410.2 R411.1 ; off-sheet MCU_USART_RXD2
MCU_USART_SCK2: R168.1 R413.1 ; off-sheet MCU_USART_SCK2
MCU_USART_TXD2: R169.1 R414.1 ; off-sheet MCU_USART_TXD2
SOLE1_OUT1: J10.1 U17.31(OUT0)
SOLE1_OUT2: J10.2 U17.30(OUT1)
SOLE2_OUT1: J10.3 U17.27(OUT2)
SOLE2_OUT2: J10.4 U17.26(OUT3)
SOLE3_OUT1: J10.5 U17.10(OUT4)
SOLE3_OUT2: J10.6 U17.11(OUT5)
SOLE4_OUT1: J10.7 U17.14(OUT6)
SOLE4_OUT2: J10.8 U17.15(OUT7)
SOLE5_OUT1: J7.1 U35.31(OUT0)
SOLE5_OUT2: J7.2 U35.30(OUT1)
SOLE6_OUT1: J7.3 U35.27(OUT2)
SOLE6_OUT2: J7.4 U35.26(OUT3)
SOLE7_OUT1: J7.5 U35.10(OUT4)
SOLE7_OUT2: J7.6 U35.11(OUT5)
SOLE8_OUT1: J7.7 U35.14(OUT6)
SOLE8_OUT2: J7.8 U35.15(OUT7)
NetC65_1: C65.1 U17.24(VCP)
NetC66_1: C66.1 U17.22(CFN)
NetC66_2: C66.2 U17.23(CFP)
NetC67_2: C67.2 U17.20(V18)
NetC409_1: C409.1 U35.24(VCP)
NetC410_1: C410.1 U35.22(CFN)
NetC410_2: C410.2 U35.23(CFP)
NetC411_2: C411.2 U35.20(V18)
NetR164_2: R164.2 U17.1(*FAULT)
NetR166_2: R166.2 U17.7(SDO)
NetR167_2: R167.2 U17.3(*CSB)
NetR168_2: R168.2 U17.5(SCK)
NetR169_2: R169.2 U17.6(SDI)
NetR170_2: R170.2 U17.21(ENABLE)
NetR171_2: R171.2 U17.2(CMD)
NetR172_2: R172.2 U17.18(IREF)
NetR409_2: R409.2 U35.1(*FAULT)
NetR411_2: R411.2 U35.7(SDO)
NetR412_2: R412.2 U35.3(*CSB)
NetR413_2: R413.2 U35.5(SCK)
NetR414_2: R414.2 U35.6(SDI)
NetR415_2: R415.2 U35.21(ENABLE)
NetR416_2: R416.2 U35.2(CMD)
NetR417_2: R417.2 U35.18(IREF)

Not connected (* = marked no-connect by the designer): U17 8(TRIGA)* 17(TRIGB)*; U35 8(TRIGA)* 17(TRIGB)*

### Notes on the sheet
- SOLENOID
- (near U17) O_OD
- (near U17) I_IPU
- (near U17) I_IPD
- (near U35) O_OD
- O_OD
- (near U35) I_IPU
- (near U35) I_IPD
- I_IPD
- Project
- Sub-system:
- Design by:
- Sheet title:
- Sheet:
- of
- Checked by:
- Approved by:
- Doc no:
- Revision
- Size:
- Date:

### Library data of the parts
C62-C65 C67 C406-C409 C411 = _CAP_C_2: CAP
C66 C410 = _CAP_C_2: CAP CHIP
J7 J10 = Header 8x1_2M
R164-R172 R409-R417 = _RES_B_2: RES
U17 U35 = MAX22200ETJ+T: 36V, 1A Octal Integrated Serial-Controlled Solenoid and Motor Driver; Manufacturer_Name: Analog Devices Inc; Copyright: Copyright (C) 2026 Ultra Librarian. All rights reserved.; Manufacturer_Part_Number: MAX22200ETJ+T; RefDes: RefDes; Type: Type

## Sheet IR_LED.SchDoc
size 420 x 297 mm; SheetNumber: 10; SheetTotal: 19
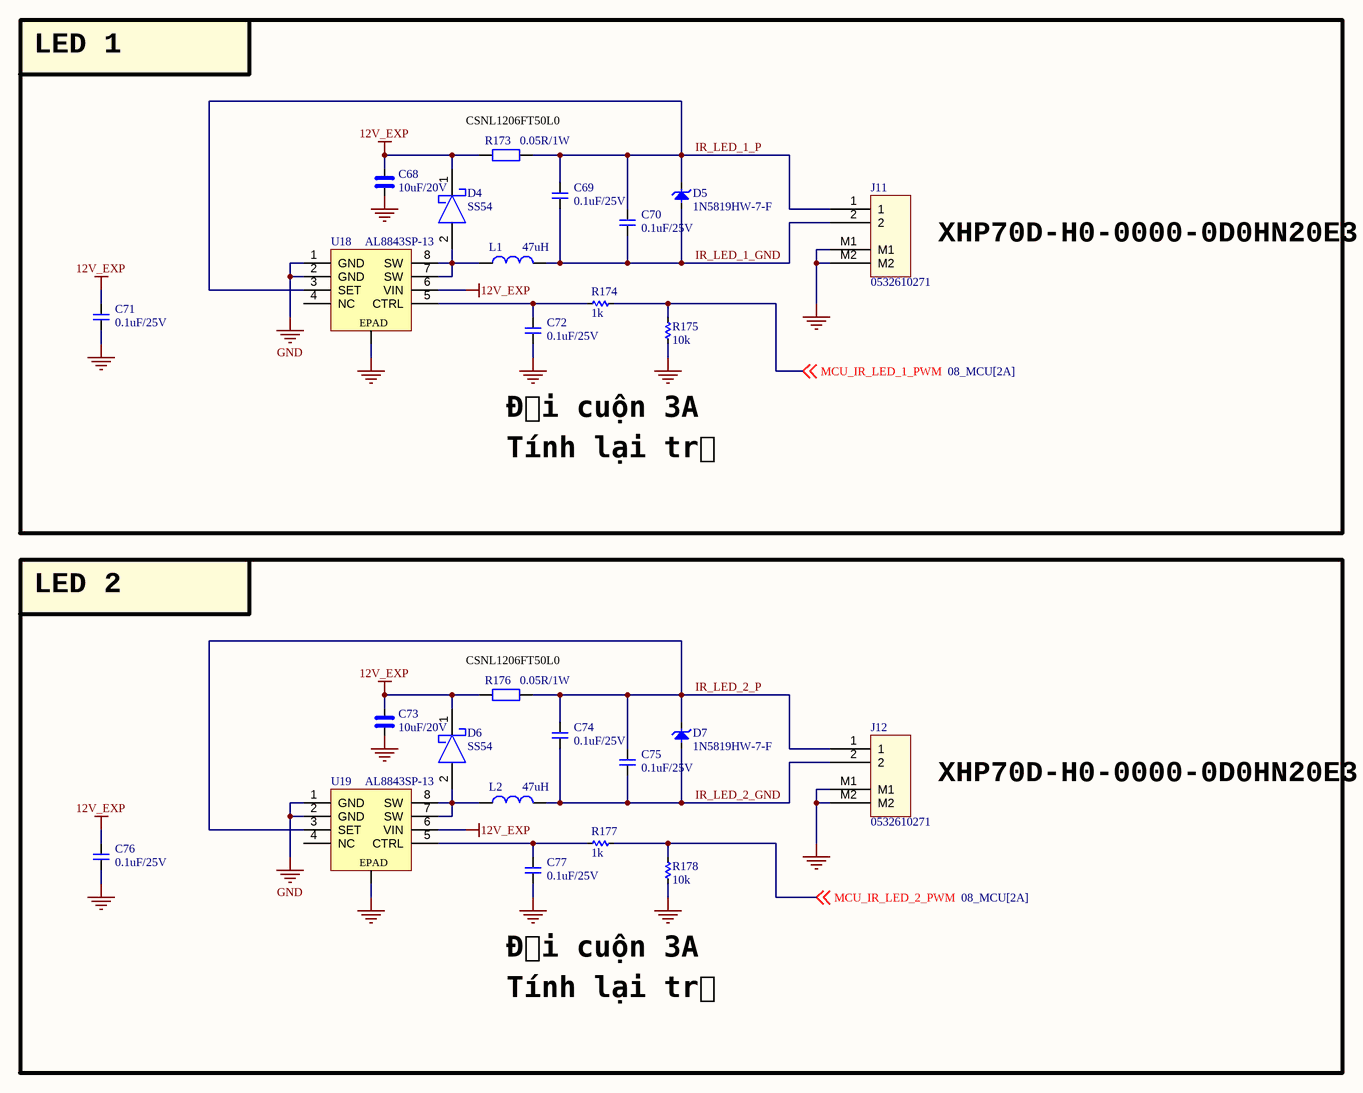
[diagram p13: IR_LED.SchDoc]

### Parts
C68  10uF/20V  [CAP_C_2012X110]
C69  0.1uF/25V  [CAP_C_1608X80]
C70  0.1uF/25V  [CAP_C_1608X80]
C71  0.1uF/25V  [CAP_C_1608X80]
C72  0.1uF/25V  [CAP_C_1608X80]
C73  10uF/20V  [CAP_C_2012X110]
C74  0.1uF/25V  [CAP_C_1608X80]
C75  0.1uF/25V  [CAP_C_1608X80]
C76  0.1uF/25V  [CAP_C_1608X80]
C77  0.1uF/25V  [CAP_C_1608X80]
D4  SS54  [DO-214AC_SMA]
D5  1N5819HW-7-F  [SOD3717X145N]
D6  SS54  [DO-214AC_SMA]
D7  1N5819HW-7-F  [SOD3717X145N]
J11  0532610271  [MOLEX_5040500291]
J12  0532610271  [MOLEX_5040500291]
L1  47uH  [IND_MP_1250x1250x850]
L2  47uH  [IND_MP_1250x1250x850]
R173  0.05R/1W  [RES_C_3216X70]
R174  1k  [RES_C_1608X60]
R175  10k  [RES_C_1608X60]
R176  0.05R/1W  [RES_C_3216X70]
R177  1k  [RES_C_1608X60]
R178  10k  [RES_C_1608X60]
U18  AL8843SP-13  [SOIC127P602X173-8N_EPAD]
U19  AL8843SP-13  [SOIC127P602X173-8N_EPAD]

### Nets
12V_EXP: C68.1 C71.2 C73.1 C76.2 D4.1 D6.1 R173.1 R176.1 U18.6(VIN) U19.6(VIN)
GND: C68.2 C71.1 C72.1 C73.2 C76.1 C77.1 J11.M1 J11.M2 J12.M1 J12.M2 R175.2 R178.2 U18.1(GND) U18.2(GND) U18.9(EPAD) U19.1(GND) U19.2(GND) U19.9(EPAD)
IR_LED_1_GND: C69.1 C70.1 D5.2(A) J11.2 L1.2
IR_LED_1_P: C69.2 C70.2 D5.1(K) J11.1 R173.2 U18.3(SET)
IR_LED_2_GND: C74.1 C75.1 D7.2(A) J12.2 L2.2
IR_LED_2_P: C74.2 C75.2 D7.1(K) J12.1 R176.2 U19.3(SET)
MCU_IR_LED_1_PWM: R174.2 R175.1 ; off-sheet MCU_IR_LED_1_PWM
MCU_IR_LED_2_PWM: R177.2 R178.1 ; off-sheet MCU_IR_LED_2_PWM
NetC72_2: C72.2 R174.1 U18.5(CTRL)
NetC77_2: C77.2 R177.1 U19.5(CTRL)
NetD4_2: D4.2 L1.1 U18.7(SW) U18.8(SW)
NetD6_2: D6.2 L2.1 U19.7(SW) U19.8(SW)

Not connected (* = marked no-connect by the designer): U18 4(NC); U19 4(NC)

### Notes on the sheet
- LED 1
- (near R173) CSNL1206FT50L0
- XHP70D-H0-0000-0D0HN20E3
- Đổi cuộn 3A
- Tính lại trở
- LED 2
- (near R176) CSNL1206FT50L0
- Project:
- Sub-system:
- Design by:
- Sheet title:
- Sheet
- of
- Checked by:
- Approved by:
- Revision:
- Document No:
- Size:
- Date:
- A3

### Library data of the parts
C68 C73 = _CAP_C_High_2: CAP High Value
C69-C72 C74-C77 = _CAP_C_2: CAP
D4 D6 = SS54: DIODE SCHOTTKY 60V 3A DO214AA
D5 D7 = DIODE Zener: Zenner
J11 J12 = Header 2x1_2M
L1 L2 = L-SMD-1: B82477P4473M000; partNo: 78477010; Manufacturer: Wurth Elektronik; Inductance: 1.0 μH; ComponentLink1Description: Manufacturer; ComponentLink1URL: http://www.we-online.de; Created by: Baojun Chen; Created Date: Nov.2015; ComponentLink2Description: Datasheet; ComponentLink2URL: http://katalog.we-online.de/pbs/datasheet/78477010.pdf
R173 R176 = _RES: RES; Chung_Loai: Dán; Don_Vi: Con; So_Chan: 2; Ten_Linh_Kien: Trở 0603 1% 10k; Ma_Hang: MH006333; Kieu_Chan: *
R174 R175 R177 R178 = _RES_B_2: RES
U18 U19 = AL8843SP-13: IC LED DRIVER RGLTR PWM 3A 8SO

## Sheet STEP_MOTOR_DRIVER_1.SchDoc
size 420 x 297 mm; SheetNumber: 11; SheetTotal: 20
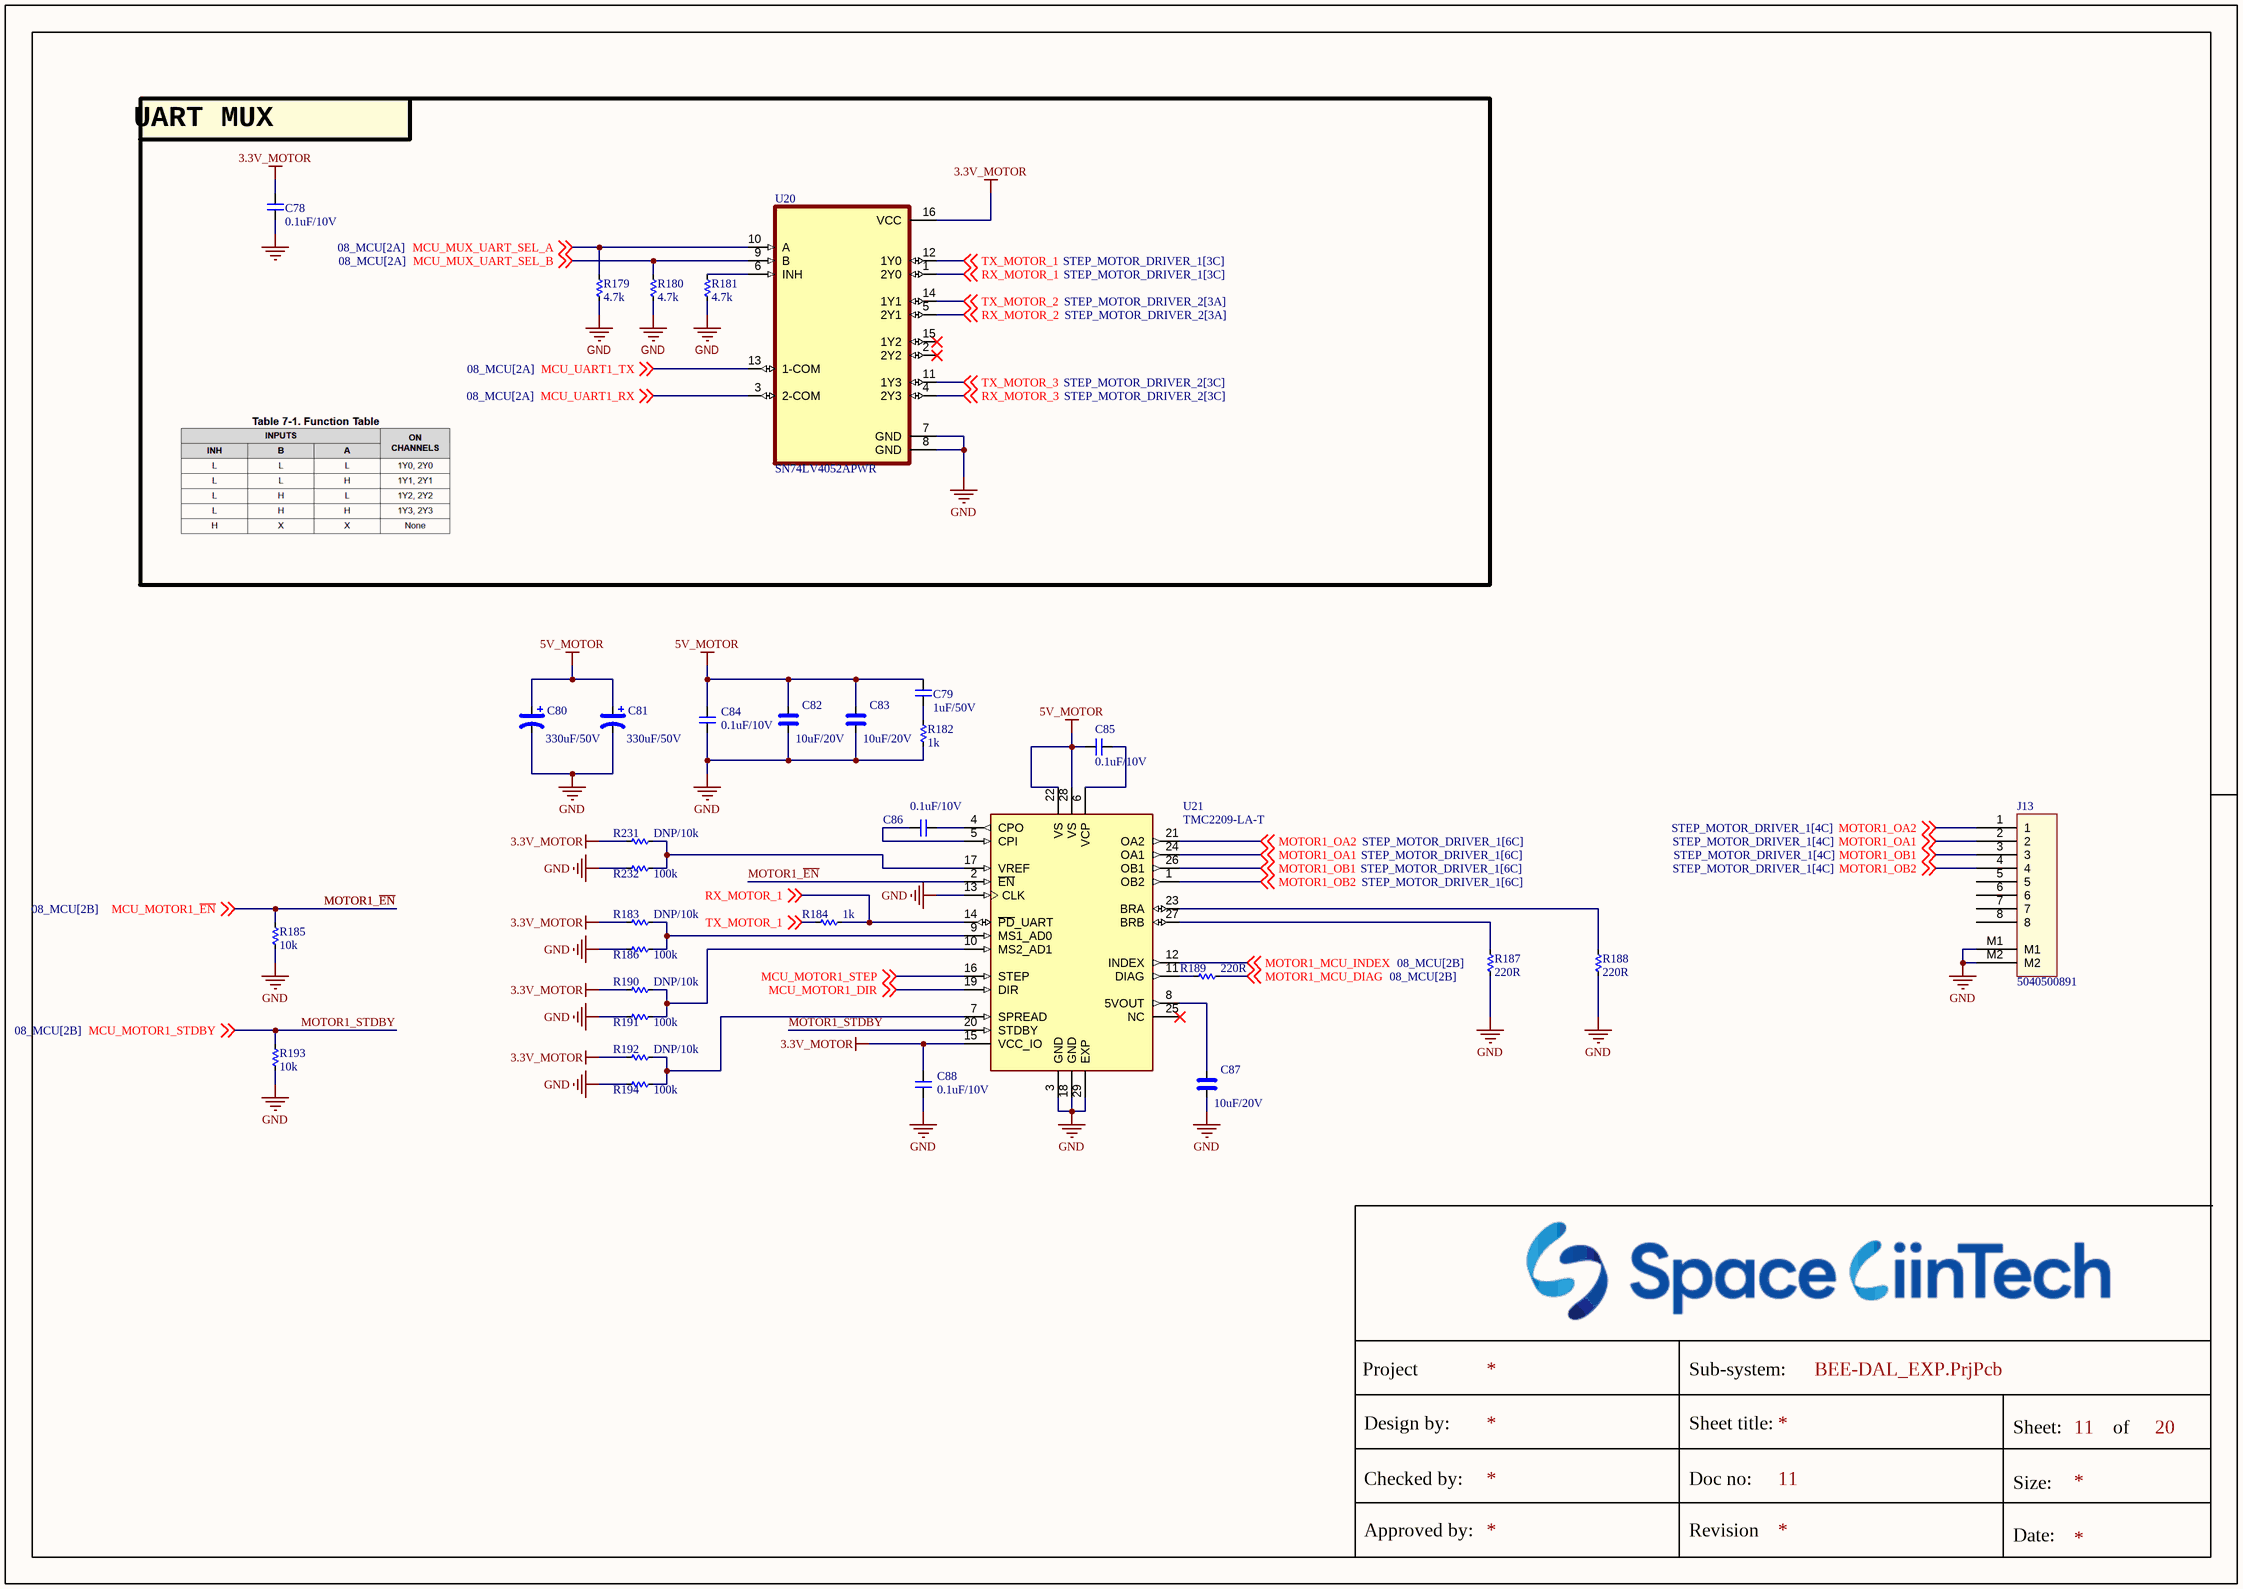
[diagram p14: STEP_MOTOR_DRIVER_1.SchDoc]

### Parts
(Parts that share a designator on the sheet are numbered #1, #2 ... from top to bottom, then left to right.)
C78  0.1uF/10V  [CAP_C_1005X50_L]
C79  1uF/50V  [CAP_C_1005X50_L]
C80  330uF/50V  [CAP_MP_3216X180]
C81  330uF/50V  [CAP_MP_3216X180]
C82  10uF/20V  [CAP_C_2012X110]
C83  10uF/20V  [CAP_C_2012X110]
C84  0.1uF/10V  [CAP_C_1005X50_L]
C85  0.1uF/10V  [CAP_C_1005X50_L]
C86  0.1uF/10V  [CAP_C_1005X50_L]
C87  10uF/20V  [CAP_C_2012X110]
C88  0.1uF/10V  [CAP_C_1005X50_L]
J13  5040500891  [MOLEX_5040500891]
R179#2  4.7k  [RES_C_1005x30_L]
R180  4.7k  [RES_C_1005x30_L]
R181  4.7k  [RES_C_1005x30_L]
R182  1k  [RES_C_1005X40]
R183  DNP/10k  [RES_C_1005X40]
R184  1k  [RES_C_1005X40]
R185  10k  [RES_C_1005X40]
R186  100k  [RES_C_1005X40]
R187  220R  [RES_C_1005X40]
R188  220R  [RES_C_1005X40]
R189  220R  [RES_C_1005X40]
R190  DNP/10k  [RES_C_1005X40]
R191  100k  [RES_C_1005X40]
R192  DNP/10k  [RES_C_1005X40]
R193  10k  [RES_C_1005X40]
R194  100k  [RES_C_1005X40]
R231#1  DNP/10k  [RES_C_1005X40]
R232#1  100k  [RES_C_1005X40]
U20  SN74LV4052APWR  [SOP65P640X120-16N]
U21  TMC2209-LA-T  [QFN50P500X500X90-29N]

### Blocks framed on the sheet
UART MUX: C78 R179#2 R180 R181 U20

### Nets
3.3V_MOTOR: C78.2 C88.2 R183.2 R190.2 R192.2 R231#1.2 U20.16(VCC) U21.15(VCC_IO)
5V_MOTOR: C79.2 C80.1 C81.1 C82.1 C83.1 C84.2 C85.2 U21.22(VS) U21.28(VS)
GND: C78.1 C80.2 C81.2 C82.2 C83.2 C84.1 C87.2 C88.1 J13.M1 J13.M2 R179#2.2 R180.2 R181.2 R182.1 R185.1 R186.2 R187.2 R188.2 R191.2 R193.1 R194.2 R232#1.2 U20.7(GND) U20.8(GND) U21.3(GND) U21.13(CLK) U21.18(GND) U21.29(EXP)
MCU_MOTOR1_DIR: U21.19(DIR) ; off-sheet MCU_MOTOR1_DIR
MCU_MOTOR1_STEP: U21.16(STEP) ; off-sheet MCU_MOTOR1_STEP
MCU_MUX_UART_SEL_A: R179#2.1 U20.10(A) ; off-sheet MCU_MUX_UART_SEL_A
MCU_MUX_UART_SEL_B: R180.1 U20.9(B) ; off-sheet MCU_MUX_UART_SEL_B
MCU_UART1_RX: U20.3(2-COM) ; off-sheet MCU_UART1_RX
MCU_UART1_TX: U20.13(1-COM) ; off-sheet MCU_UART1_TX
MOTOR1_~{EN}: R185.2 U21.2(~{EN}) ; off-sheet MCU_MOTOR1_~{EN}  [also labelled MCU_MOTOR1_~{EN}]
MOTOR1_MCU_DIAG: R189.2 ; off-sheet MOTOR1_MCU_DIAG
MOTOR1_MCU_INDEX: U21.12(INDEX) ; off-sheet MOTOR1_MCU_INDEX
MOTOR1_OA1: J13.2 U21.24(OA1) ; off-sheet MOTOR1_OA1
MOTOR1_OA2: J13.1 U21.21(OA2) ; off-sheet MOTOR1_OA2
MOTOR1_OB1: J13.3 U21.26(OB1) ; off-sheet MOTOR1_OB1
MOTOR1_OB2: J13.4 U21.1(OB2) ; off-sheet MOTOR1_OB2
MOTOR1_STDBY: R193.2 U21.20(STDBY) ; off-sheet MCU_MOTOR1_STDBY  [also labelled MCU_MOTOR1_STDBY]
RX_MOTOR_1: R184.2 U20.1(2Y0) U21.14(~{PD}_UART) ; off-sheet RX_MOTOR_1
RX_MOTOR_2: U20.5(2Y1) ; off-sheet RX_MOTOR_2
RX_MOTOR_3: U20.4(2Y3) ; off-sheet RX_MOTOR_3
TX_MOTOR_1: R184.1 U20.12(1Y0) ; off-sheet TX_MOTOR_1
TX_MOTOR_2: U20.14(1Y1) ; off-sheet TX_MOTOR_2
TX_MOTOR_3: U20.11(1Y3) ; off-sheet TX_MOTOR_3
NetC79_1: C79.1 R182.2
NetC85_1: C85.1 U21.6(VCP)
NetC86_1: C86.1 U21.4(CPO)
NetC86_2: C86.2 U21.5(CPI)
NetC87_1: C87.1 U21.8(5VOUT)
NetR181_1: R181.1 U20.6(INH)
NetR183_1: R183.1 R186.1 U21.9(MS1_AD0)
NetR187_1: R187.1 U21.27(BRB)
NetR188_1: R188.1 U21.23(BRA)
NetR189_1: R189.1 U21.11(DIAG)
NetR190_1: R190.1 R191.1 U21.10(MS2_AD1)
NetR192_1: R192.1 R194.1 U21.7(SPREAD)
NetR231#1_1: R231#1.1 R232#1.1 U21.17(VREF)

Not connected (* = marked no-connect by the designer): J13 5 6 7 8; U20 2(2Y2)* 15(1Y2)*; U21 25(NC)*

### Notes on the sheet
- Project
- Sub-system:
- Design by:
- Sheet title:
- Sheet:
- of
- Checked by:
- Approved by:
- Doc no:
- Revision
- Size:
- Date:

### Library data of the parts
C78 C79 C84-C86 C88 = _CAP_C_2: CAP
C80 C81 = _CAP_Pola_High_2: CAP Polarization High Value
C82 C83 C87 = _CAP_C_High_2: CAP High Value
J13 = Header 8x1_2M
R179#2 R180-R194 R231#1 R232#1 = _RES_B_2: RES
U20 = SN74LV4052APWR: 5-V, 4:1, 2-channel analog multiplexer; MF: Texas Instruments; SnapEDA_Link: https://www.snapeda.com/parts/SN74LV4052APWR/Texas+Instruments/view-part/?ref=snap; Package: TSSOP-16 Texas Instruments; Value: *; MP: SN74LV4052APWR; Check_prices: https://www.snapeda.com/parts/SN74LV4052APWR/Texas+Instruments/view-part/?ref=eda
U21 = TMC2209-LA-T: Bipolar Motor Driver Power MOSFET Step/Direction, UART 28-QFN (5x5); MF: Trinamic Motion Control GmbH; SnapEDA_Link: https://www.snapeda.com/parts/TMC2209-LA-T/Trinamic/view-part/?ref=snap; Package: VFQFN-28 Trinamic; Value: *; MP: TMC2209-LA-T; Check_prices: https://www.snapeda.com/parts/TMC2209-LA-T/Trinamic/view-part/?ref=eda